# EAGLE design main_v3 (EAGLE 5.10)
TME: 1206YC106KAT2A

## Sheet 1 of 6
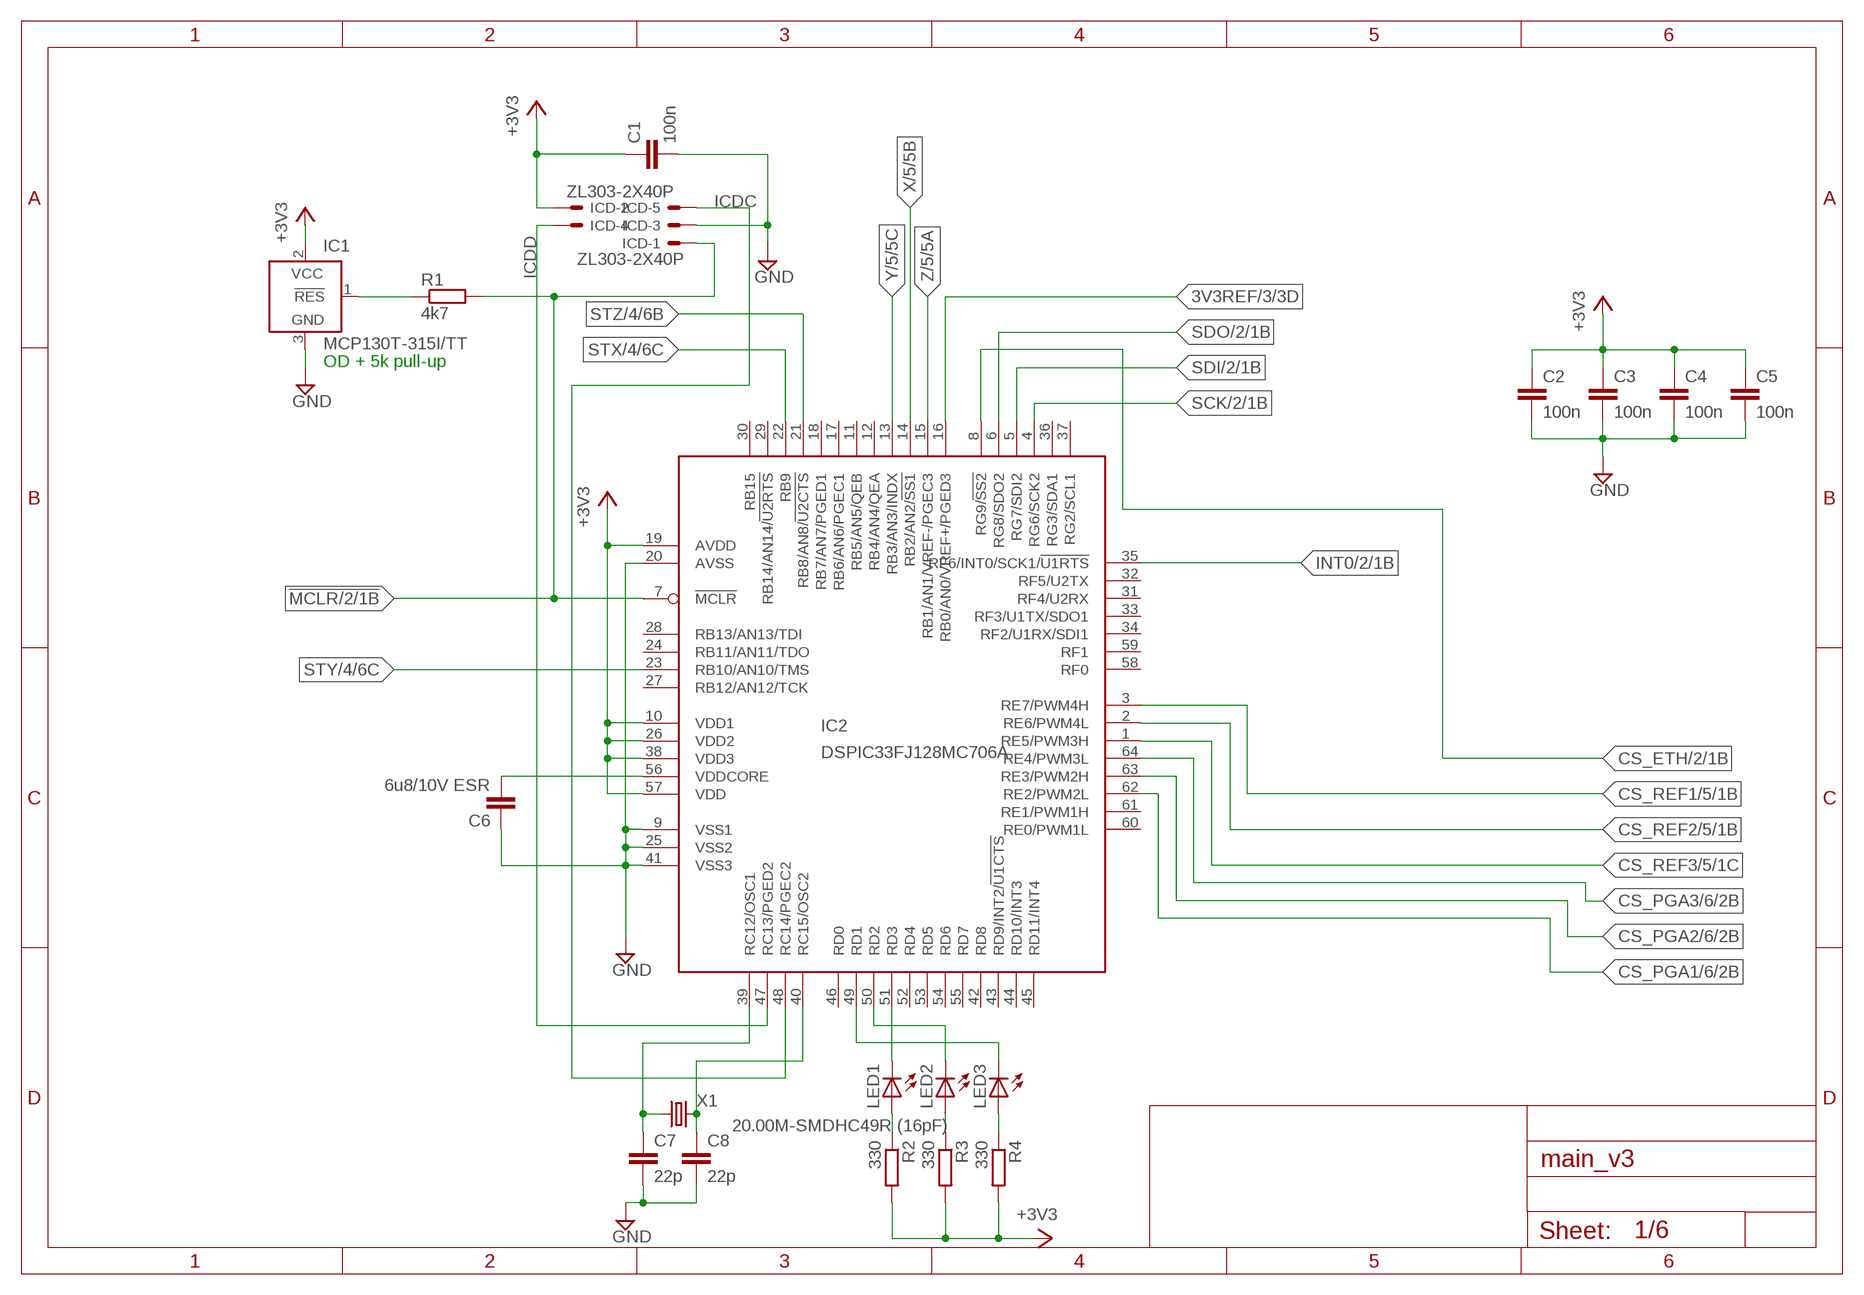
[diagram p0: schematic, sheet 1]

### Parts
C1  100n  C-EUC0805  [C0805]
C2  100n  C-EUC0805  [C0805]
C3  100n  C-EUC0805  [C0805]
C4  100n  C-EUC0805  [C0805]
C5  100n  C-EUC0805  [C0805]
C6  6u8/10V ESR  C-EUC1210  [C1210]
C7  22p  C-EUC0805  [C0805]
C8  22p  C-EUC0805  [C0805]
IC1  MCP130T-315I/TT  MCP10T  [SOT23B-3]
IC2  DSPIC33FJ128MC706A  DSPIC33FJ128MC706  [TQFP64_10X10]
ICD  ZL303-2X40P  87758-0616  [87758-0616]
LED1  LEDCHIPLED_1206  [CHIPLED_1206]
LED2  LEDCHIPLED_1206  [CHIPLED_1206]
LED3  LEDCHIPLED_1206  [CHIPLED_1206]
R1  4k7  R-EU_R0805  [R0805]
R2  330  R-EU_R0805  [R0805]
R3  330  R-EU_R0805  [R0805]
R4  330  R-EU_R0805  [R0805]
X1  20.00M-SMDHC49R (16pF)  CRYSTALHC49UP  [HC49UP]

### Nets
3V3REF: IC2.16(RB0/AN0/VREF+/PGED3) ; also sheet 3
!MCLR: IC2.7(!MCLR) ICD.1 R1.2 ; also sheet 2
+3V3: C1.1 C2.1 C3.1 C4.1 C5.1 IC1.2(VCC) IC2.10(VDD1) IC2.19(AVDD) IC2.26(VDD2) IC2.38(VDD3) IC2.57(VDD) ICD.2 R2.2 R3.2 R4.2 ; also sheet 2,3,5
CS_ETH: IC2.8(RG9/!SS2) ; also sheet 2
CS_PGA1: IC2.62(RE2/PWM2L) ; also sheet 6
CS_PGA2: IC2.63(RE3/PWM2H) ; also sheet 6
CS_PGA3: IC2.64(RE4/PWM3L) ; also sheet 6
CS_REF1: IC2.3(RE7/PWM4H) ; also sheet 5
CS_REF2: IC2.2(RE6/PWM4L) ; also sheet 5
CS_REF3: IC2.1(RE5/PWM3H) ; also sheet 5
GND: C1.2 C2.2 C3.2 C4.2 C5.2 C6.1 C7.2 C8.2 IC1.3(GND) IC2.9(VSS1) IC2.20(AVSS) IC2.25(VSS2) IC2.41(VSS3) ICD.3 ; also sheet 2,3,6
ICDC: IC2.48(RC14/PGEC2) ICD.5
ICDD: IC2.47(RC13/PGED2) ICD.4
INT0: IC2.35(RF6/INT0/SCK1/!U1RTS) ; also sheet 2
LED0: IC2.50(RD2) LED2.C
LED1: IC2.49(RD1) LED3.C
LED2: IC2.51(RD3) LED1.C
N$46: C6.2 IC2.56(VDDCORE)
N$47: IC1.1(!RES) R1.1
N$48: C8.1 IC2.40(RC15/OSC2) X1.2
N$49: C7.1 IC2.39(RC12/OSC1) X1.1
N$60: LED3.A R4.1
N$61: LED2.A R3.1
N$62: LED1.A R2.1
SCK: IC2.4(RG6/SCK2) ; also sheet 2,5,6
SDI: IC2.5(RG7/SDI2) ; also sheet 2
SDO: IC2.6(RG8/SDO2) ; also sheet 2,5,6
STX: IC2.22(RB9) ; also sheet 4
STY: IC2.23(RB10/AN10/TMS) ; also sheet 4
STZ: IC2.21(RB8/AN8/!U2CTS) ; also sheet 4
X: IC2.14(RB2/AN2/!SS1) ; also sheet 5
Y: IC2.13(RB3/AN3/INDX) ; also sheet 5
Z: IC2.15(RB1/AN1/VREF-/PGEC3) ; also sheet 5
Unconnected: IC2.11(RB5/AN5/QEB) IC2.12(RB4/AN4/QEA) IC2.17(RB6/AN6/PGEC1) IC2.18(RB7/AN7/PGED1) IC2.24(RB11/AN11/TDO) IC2.27(RB12/AN12/TCK) IC2.28(RB13/AN13/TDI) IC2.29(RB14/AN14/!U2RTS) IC2.30(RB15) IC2.31(RF4/U2RX) IC2.32(RF5/U2TX) IC2.33(RF3/U1TX/SDO1) IC2.34(RF2/U1RX/SDI1) IC2.36(RG3/SDA1) IC2.37(RG2/SCL1) IC2.42(RD8) IC2.43(RD9/INT2/!U1CTS) IC2.44(RD10/INT3) IC2.45(RD11/INT4) IC2.46(RD0) IC2.52(RD4) IC2.53(RD5) IC2.54(RD6) IC2.55(RD7) IC2.58(RF0) IC2.59(RF1) IC2.60(RE0/PWM1L) IC2.61(RE1/PWM1H) ICD.6

### Notes on the sheet
- OD + 5k pull-up

## Sheet 2 of 6
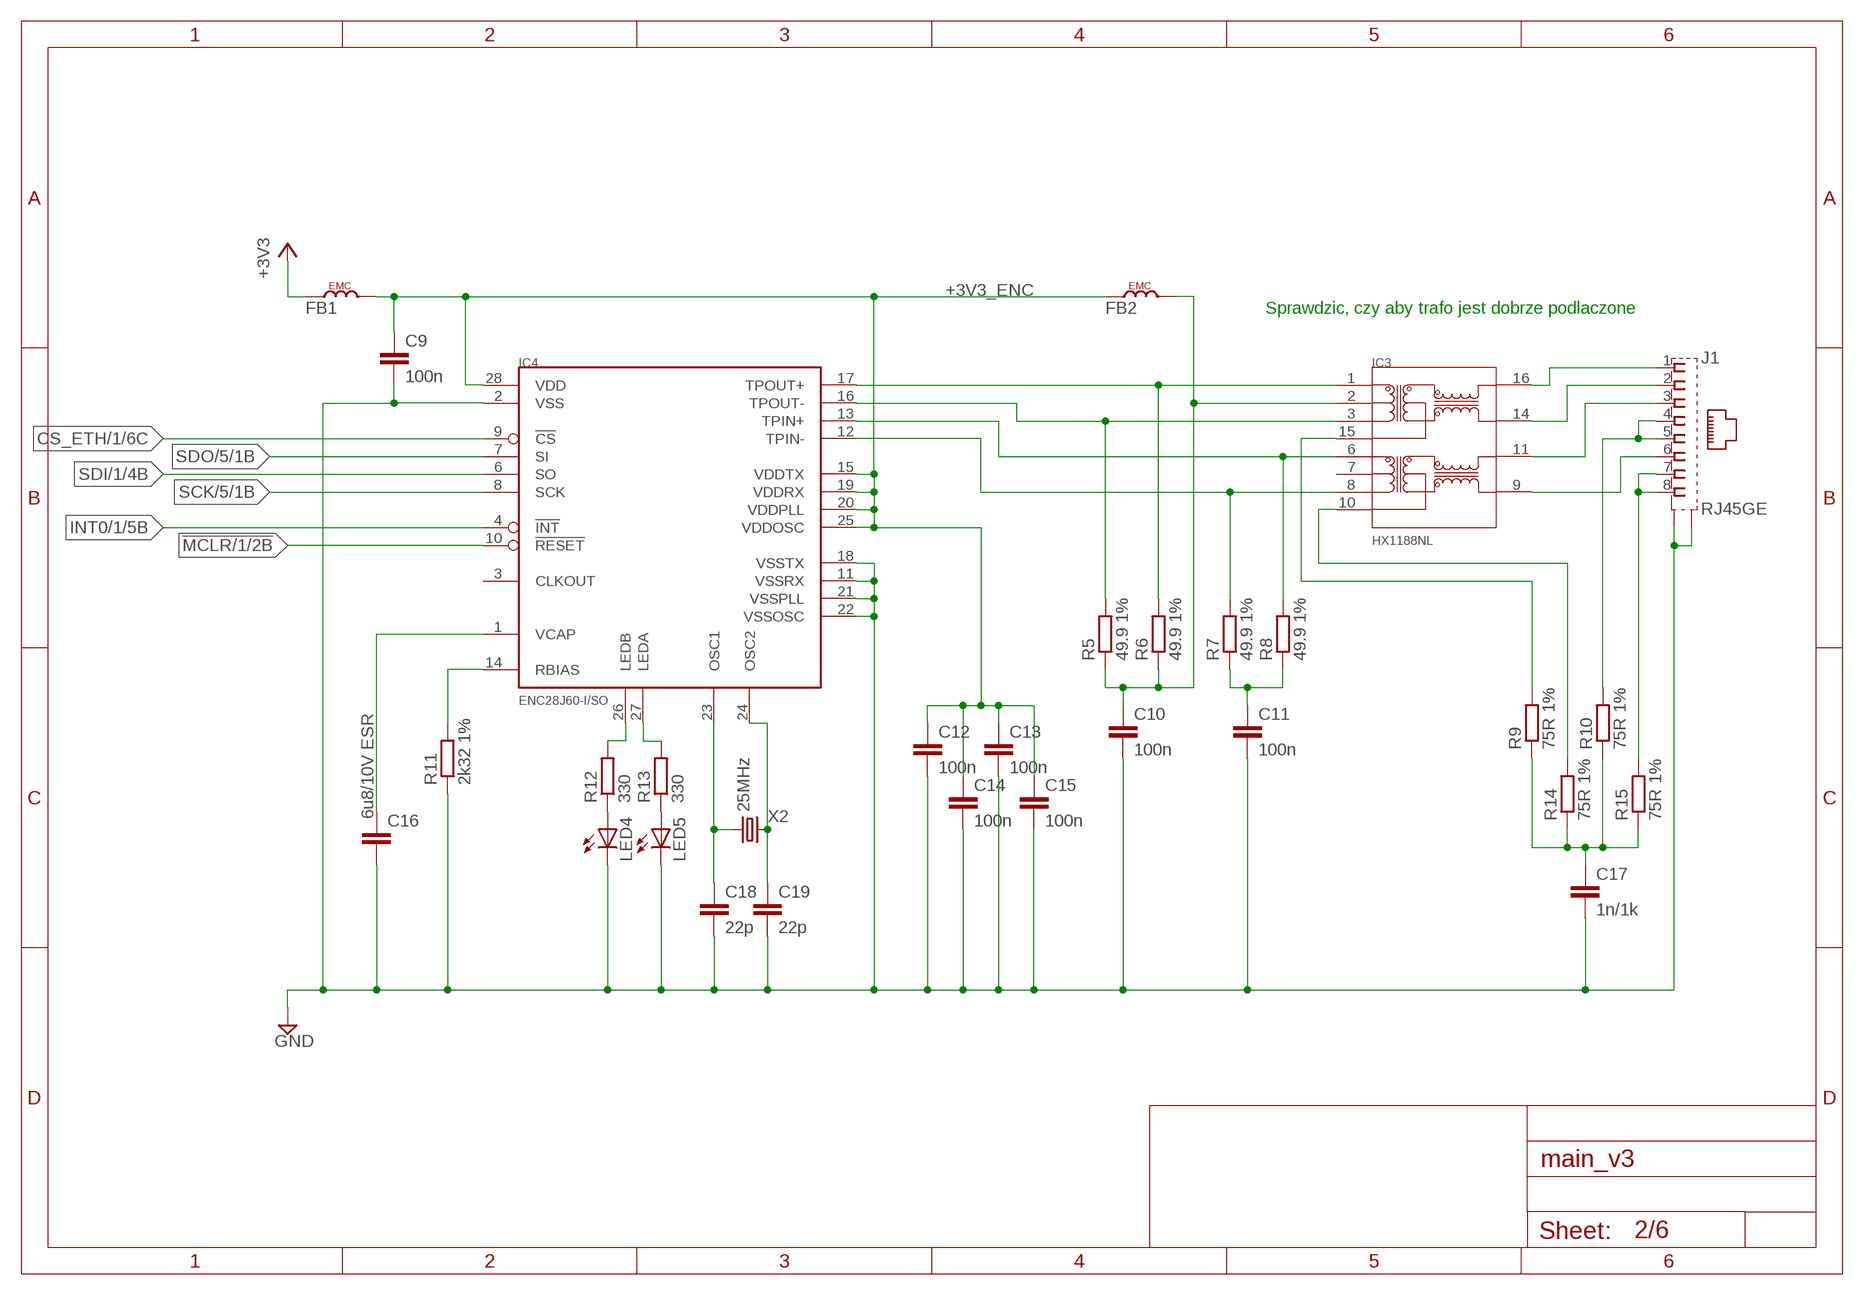
[diagram p1: schematic, sheet 2]

### Parts
C9  100n  C-EUC0805  [C0805]
C10  100n  C-EUC0805  [C0805]
C11  100n  C-EUC0805  [C0805]
C12  100n  C-EUC0805  [C0805]
C13  100n  C-EUC0805  [C0805]
C14  100n  C-EUC0805  [C0805]
C15  100n  C-EUC0805  [C0805]
C16  6u8/10V ESR  C-EUC1210  [C1210]
C17  1n/1k  C-EUC0805  [C0805]
C18  22p  C-EUC0805  [C0805]
C19  22p  C-EUC0805  [C0805]
FB1  FERRITE_BEAD0805  [R0805]
FB2  FERRITE_BEAD0805  [R0805]
IC3  HX1188NL  [TRAFO_H*NL]
IC4  ENC28J60-I/SO  [SO28W]
J1  RJ45GE  555153-1  [555153-1]
LED4  LEDCHIPLED_1206  [CHIPLED_1206]
LED5  LEDCHIPLED_1206  [CHIPLED_1206]
R5  49.9 1%  R-EU_M0805  [M0805]
R6  49.9 1%  R-EU_M0805  [M0805]
R7  49.9 1%  R-EU_M0805  [M0805]
R8  49.9 1%  R-EU_M0805  [M0805]
R9  75R 1%  R-EU_R0805  [R0805]
R10  75R 1%  R-EU_R0805  [R0805]
R11  2k32 1%  R-EU_R1206  [R1206]
R12  330  R-EU_R0805  [R0805]
R13  330  R-EU_R0805  [R0805]
R14  75R 1%  R-EU_R0805  [R0805]
R15  75R 1%  R-EU_R0805  [R0805]
X2  25MHz  CRYSTALHC49UP  [HC49UP]

### Nets
!MCLR: IC4.10(!RESET) ; also sheet 1
+3V3: FB1.1 ; also sheet 1,3,5
+3V3_ENC: C9.1 C12.1 C13.1 C14.1 C15.1 FB1.2 FB2.1 IC4.15(VDDTX) IC4.19(VDDRX) IC4.20(VDDPLL) IC4.25(VDDOSC) IC4.28(VDD)
CS_ETH: IC4.9(!CS) ; also sheet 1
GND: C9.2 C10.2 C11.2 C12.2 C13.2 C14.2 C15.2 C16.2 C17.2 C18.2 C19.2 IC4.2(VSS) IC4.11(VSSRX) IC4.18(VSSTX) IC4.21(VSSPLL) IC4.22(VSSOSC) J1.G1(S1) J1.G2(S2) LED4.C LED5.C R11.1 ; also sheet 1,3,6
INT0: IC4.4(!INT) ; also sheet 1
N$5: IC3.15 R9.2
N$6: C10.1 FB2.2 IC3.2 R5.1 R6.1
N$7: IC3.10 R14.2
N$8: C11.1 R7.1 R8.1
N$9: C17.1 R9.1 R10.1 R14.1 R15.1
N$14: J1.4 J1.5 R10.2
N$15: J1.7 J1.8 R15.2
N$16: C19.1 IC4.24(OSC2) X2.2
N$17: C18.1 IC4.23(OSC1) X2.1
N$18: IC4.14(RBIAS) R11.2
N$19: C16.1 IC4.1(VCAP)
N$22: LED4.A R12.1
N$23: LED5.A R13.1
N$24: IC4.26(LEDB) R12.2
N$25: IC4.27(LEDA) R13.2
SCK: IC4.8(SCK) ; also sheet 1,5,6
SDI: IC4.6(SO) ; also sheet 1
SDO: IC4.7(SI) ; also sheet 1,5,6
TPIN+1: IC3.6 IC4.13(TPIN+) R8.2
TPIN+2: IC3.11 J1.3
TPIN-1: IC3.8 IC4.12(TPIN-) R7.2
TPIN-2: IC3.9 J1.6
TPOUT+1: IC3.1 IC4.17(TPOUT+) R6.2
TPOUT+2: IC3.16 J1.1
TPOUT-1: IC3.3 IC4.16(TPOUT-) R5.2
TPOUT-2: IC3.14 J1.2
Unconnected: IC3.7 IC4.3(CLKOUT)

### Notes on the sheet
- Sprawdzic, czy aby trafo jest dobrze podlaczone

## Sheet 3 of 6
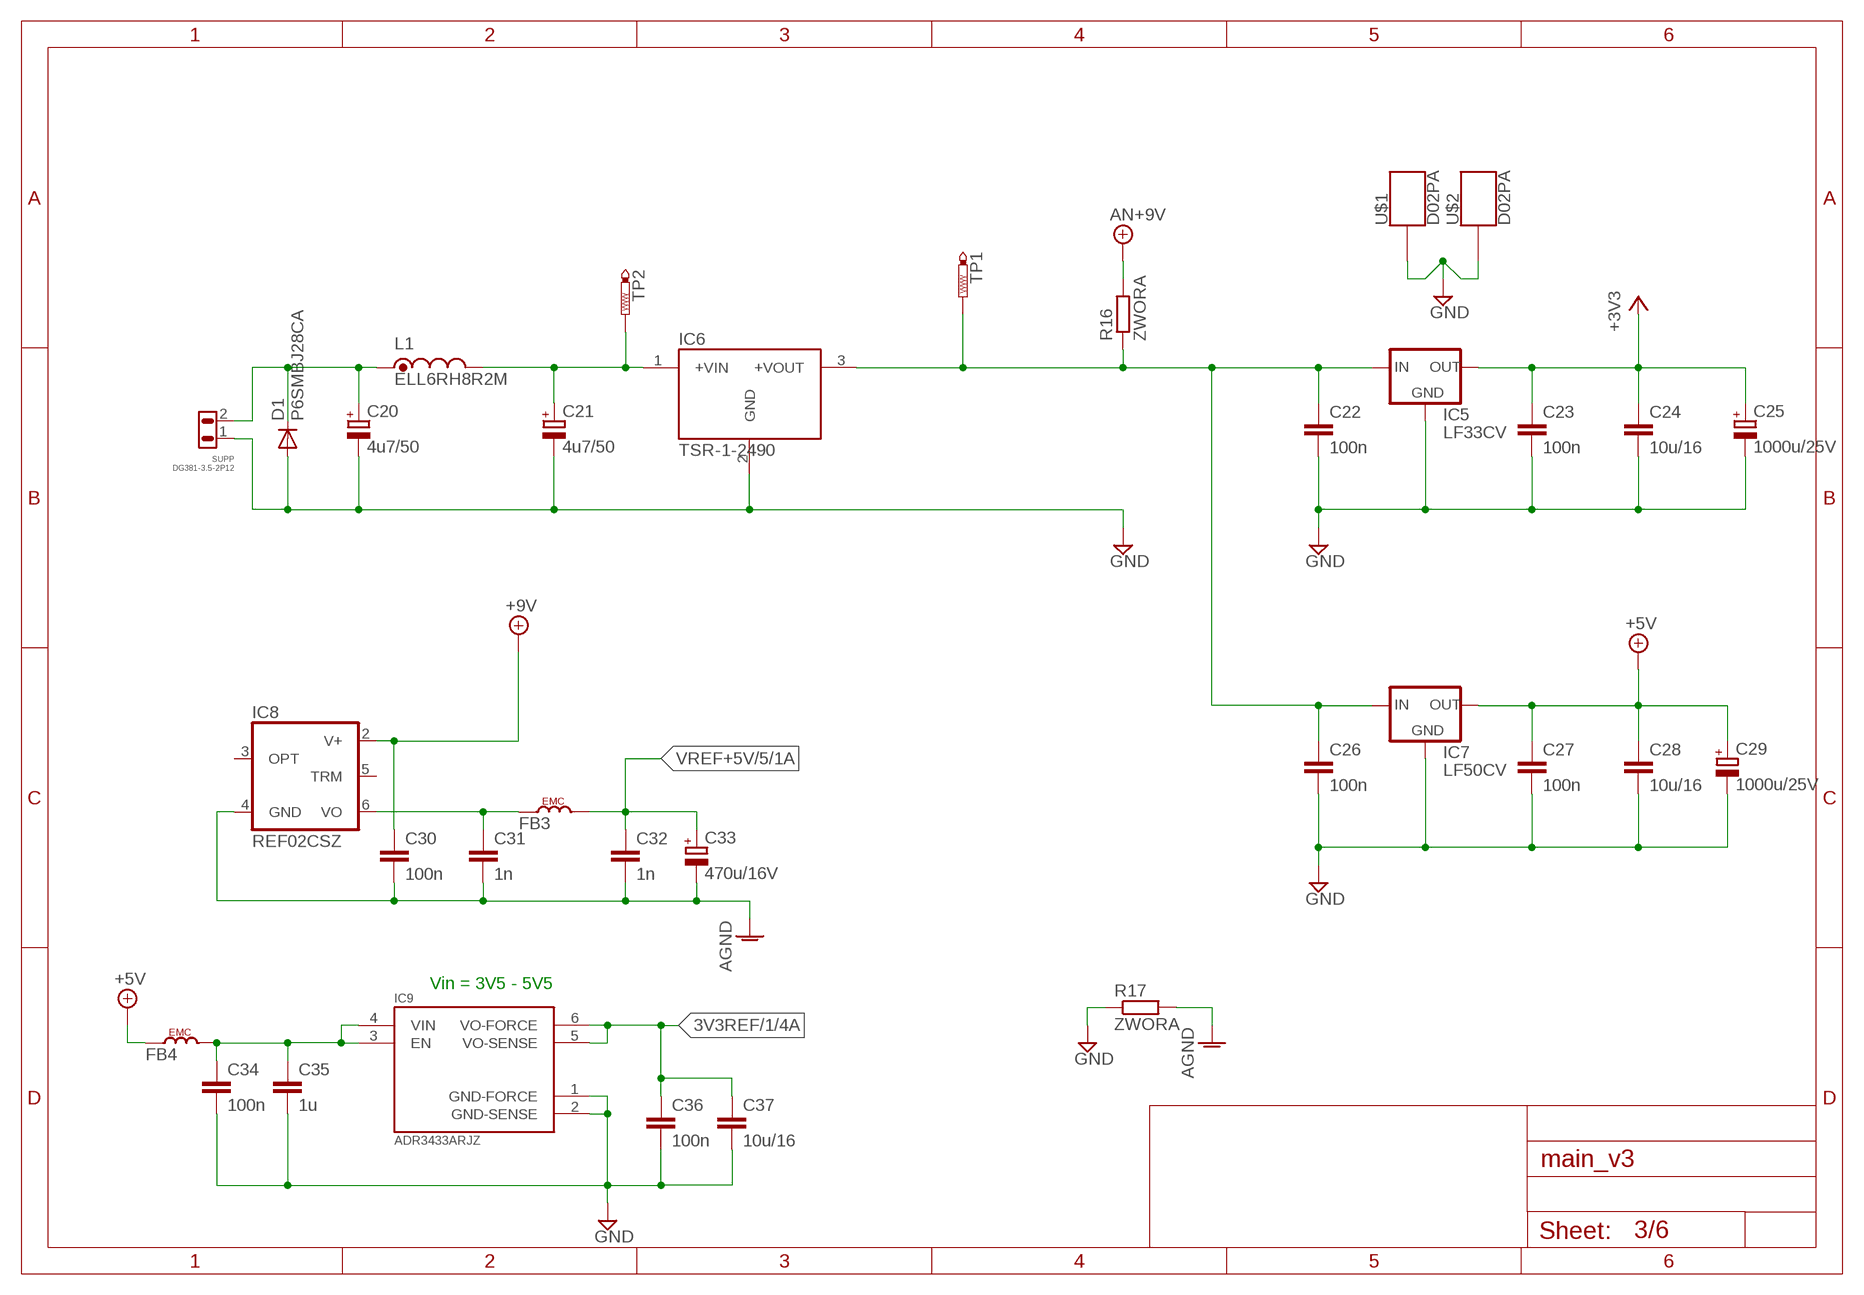
[diagram p2: schematic, sheet 3]

### Parts
C20  4u7/50  CPOL-EUUD-5X5,8  [UD-5X5,8_NICHICON]
C21  4u7/50  CPOL-EUUD-5X5,8  [UD-5X5,8_NICHICON]
C22  100n  C-EUC0805  [C0805]
C23  100n  C-EUC0805  [C0805]
C24  10u/16  C-EUC1206K  [C1206K]
C25  1000u/25V  CPOL-EUTT5D10  [TT5D10]
C26  100n  C-EUC0805  [C0805]
C27  100n  C-EUC0805  [C0805]
C28  10u/16  C-EUC1206K  [C1206K]
C29  1000u/25V  CPOL-EUTT5D10  [TT5D10]
C30  100n  C-EUC0805  [C0805]
C31  1n  C-EUC0805  [C0805]
C32  1n  C-EUC0805  [C0805]
C33  470u/16V  CPOL-EUE3.5-8  [E3,5-8]
C34  100n  C-EUC0805  [C0805]
C35  1u  C-EUC1206  [C1206]
C36  100n  C-EUC0805  [C0805]
C37  10u/16  C-EUC1206K  [C1206K]
D1  P6SMBJ28CA  DIODE-DO214AA  [DO214AA]
FB3  FERRITE_BEAD0805  [R0805]
FB4  FERRITE_BEAD0805  [R0805]
IC5  LF33CV  78XXS  [78XXS]
IC6  TSR-1-2490  [TSR1]
IC7  LF50CV  78XXS  [78XXS]
IC8  REF02CSZ  REF02D  [SO08]
IC9  ADR3433ARJZ  [SOT23-6]
L1  ELL6RH8R2M  [L_PKG_60X60]
R16  ZWORA  R-EU_M1206  [M1206]
R17  ZWORA  R-EU_M1206  [M1206]
SUPP  DG381-3.5-2P12  DG318-3.5-2P  [DG381X2-3.5]
TP1  PTR1PAD1-13  [P1-13]
TP2  PTR1PAD1-13  [P1-13]
U$1  D02PA  [D02PA]
U$2  D02PA  [D02PA]

### Nets
3V3REF: C36.1 C37.1 IC9.5(VO-SENSE) IC9.6(VO-FORCE) ; also sheet 1
+3V3: C23.1 C24.1 C25.+ IC5.OUT ; also sheet 1,2,5
+5V: C27.1 C28.1 C29.+ FB4.1 IC7.OUT ; also sheet 5
AGND: C30.2 C31.2 C32.2 C33.- IC8.4(GND) R17.2 ; also sheet 4,5
AN+9V: C30.1 IC8.2(V+) R16.2 ; supply symbol labelled +9V ; also sheet 4
GND: C20.- C21.- C22.2 C23.2 C24.2 C25.- C26.2 C27.2 C28.2 C29.- C34.2 C35.2 C36.2 C37.2 D1.A IC5.GND IC6.2(GND) IC7.GND IC9.1(GND-FORCE) IC9.2(GND-SENSE) R17.1 SUPP.1 U$1.P$1 U$2.P$1 ; also sheet 1,2,6
N$12: C34.1 C35.1 FB4.2 IC9.3(EN) IC9.4(VIN)
N$13: C31.1 FB3.1 IC8.6(VO)
N$30: C22.1 C26.1 IC5.IN IC6.3(+VOUT) IC7.IN R16.1 TP1.TP
N$35: C21.+ IC6.1(+VIN) L1.2(OUT) TP2.TP
N$41: C20.+ D1.C L1.1(IN) SUPP.2
VREF+5V: C32.1 C33.+ FB3.2 ; also sheet 5
Unconnected: IC8.3(OPT) IC8.5(TRM)

### Notes on the sheet
- Vin = 3V5 - 5V5

## Sheet 4 of 6
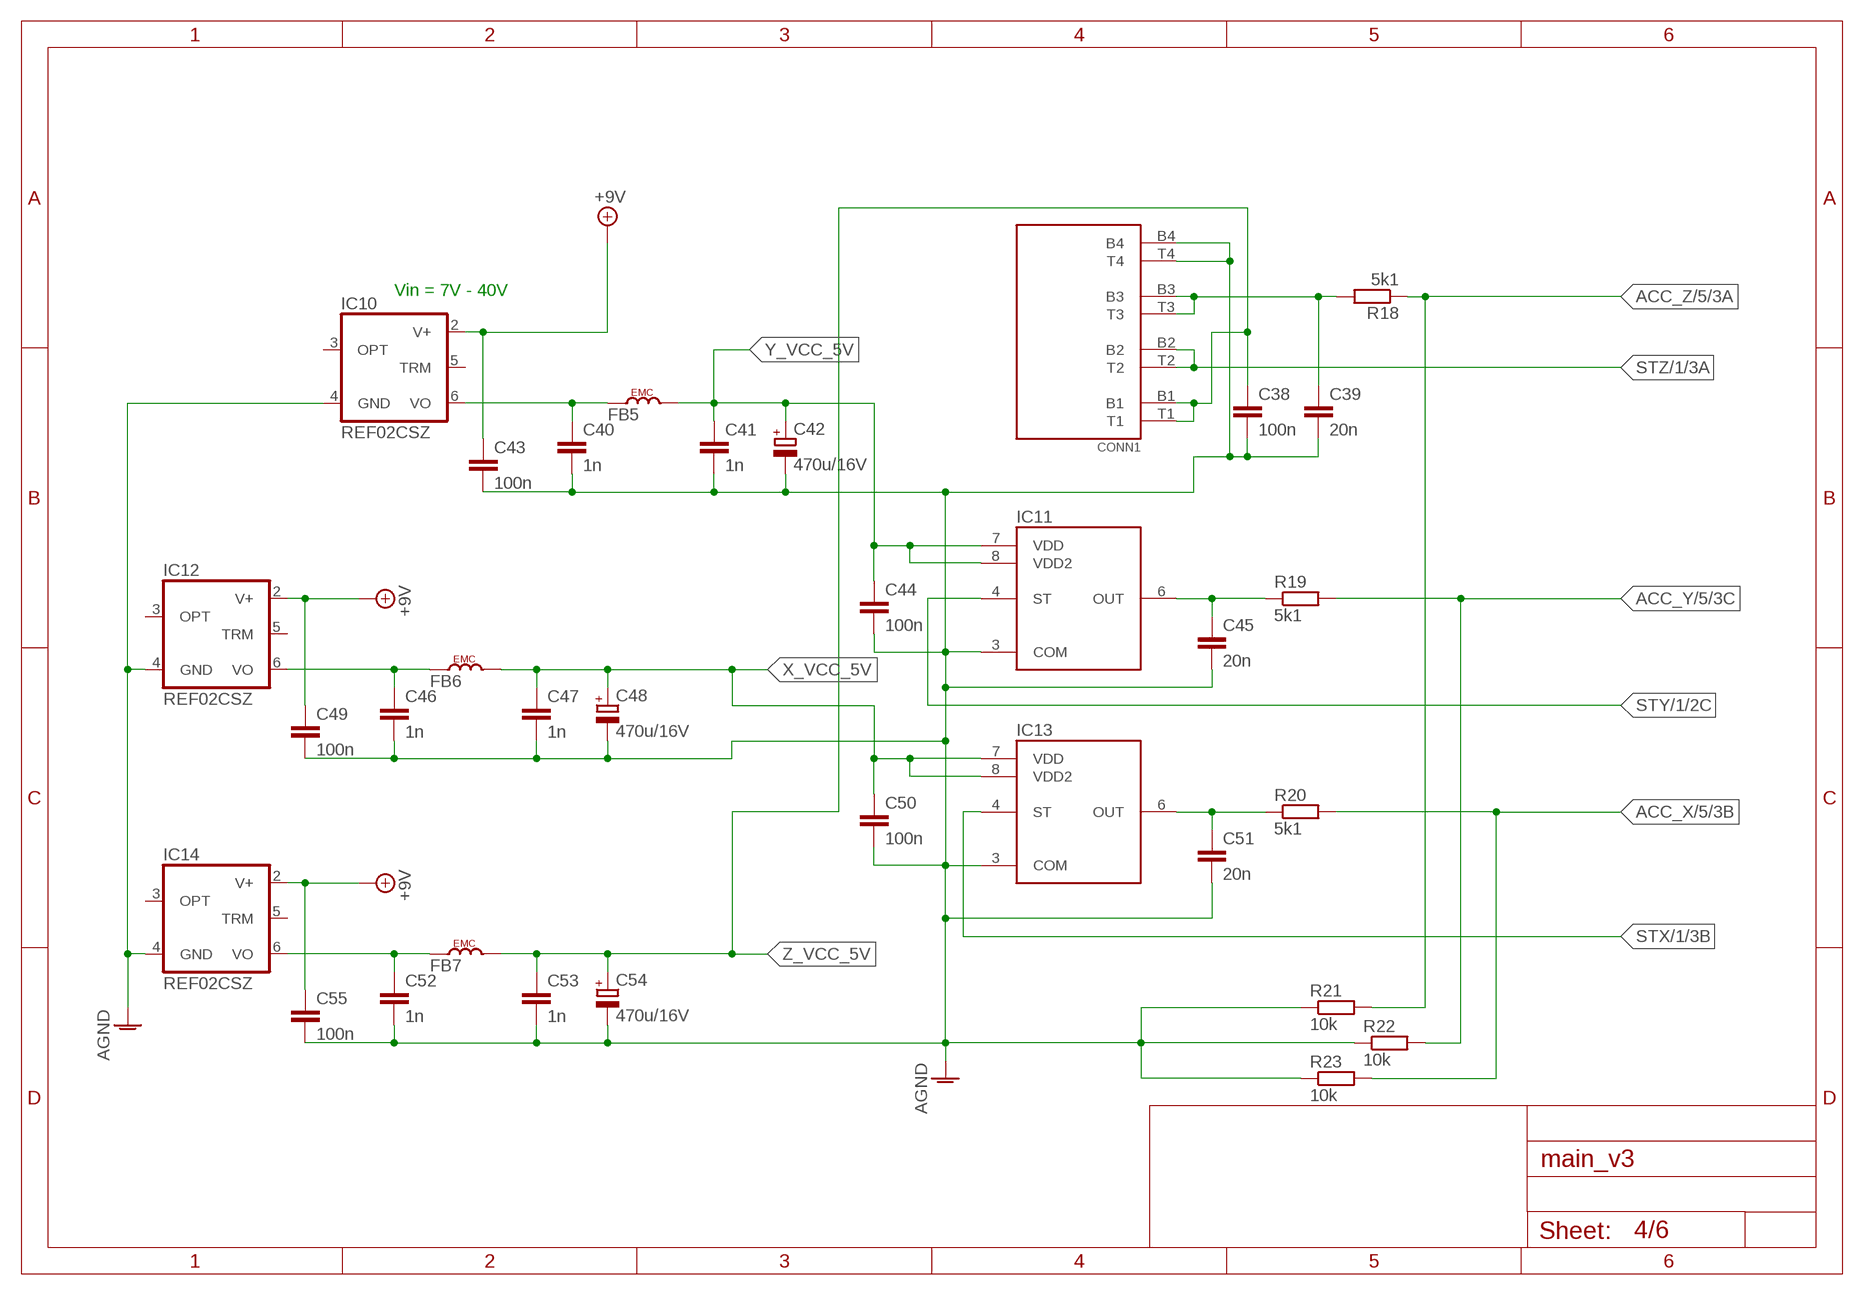
[diagram p3: schematic, sheet 4]

### Parts
C38  100n  C-EUC0805  [C0805]
C39  20n  C-EUC0805  [C0805]
C40  1n  C-EUC0805  [C0805]
C41  1n  C-EUC0805  [C0805]
C42  470u/16V  CPOL-EUE3.5-8  [E3,5-8]
C43  100n  C-EUC0805  [C0805]
C44  100n  C-EUC0805  [C0805]
C45  20n  C-EUC0805  [C0805]
C46  1n  C-EUC0805  [C0805]
C47  1n  C-EUC0805  [C0805]
C48  470u/16V  CPOL-EUE3.5-8  [E3,5-8]
C49  100n  C-EUC0805  [C0805]
C50  100n  C-EUC0805  [C0805]
C51  20n  C-EUC0805  [C0805]
C52  1n  C-EUC0805  [C0805]
C53  1n  C-EUC0805  [C0805]
C54  470u/16V  CPOL-EUE3.5-8  [E3,5-8]
C55  100n  C-EUC0805  [C0805]
CONN1  GNIAZDO4  [GNIAZDO]
FB5  FERRITE_BEAD0805  [R0805]
FB6  FERRITE_BEAD0805  [R0805]
FB7  FERRITE_BEAD0805  [R0805]
IC10  REF02CSZ  REF02D  [SO08]
IC11  ADXL001-70L  [LCC8_LONG]
IC12  REF02CSZ  REF02D  [SO08]
IC13  ADXL001-70L  [LCC8_LONG]
IC14  REF02CSZ  REF02D  [SO08]
R18  5k1  R-EU_M0805  [M0805]
R19  5k1  R-EU_M0805  [M0805]
R20  5k1  R-EU_M0805  [M0805]
R21  10k  R-EU_M0805  [M0805]
R22  10k  R-EU_M0805  [M0805]
R23  10k  R-EU_M0805  [M0805]

### Nets
ACC_X: R20.2 R23.2 ; also sheet 5
ACC_Y: R19.2 R22.2 ; also sheet 5
ACC_Z: R18.1 R21.2 ; also sheet 5
AGND: C38.2 C39.2 C40.2 C41.2 C42.- C43.2 C44.2 C45.2 C46.2 C47.2 C48.- C49.2 C50.2 C51.2 C52.2 C53.2 C54.- C55.2 CONN1.B4 CONN1.T4 IC10.4(GND) IC11.3(COM) IC12.4(GND) IC13.3(COM) IC14.4(GND) R21.1 R22.1 R23.1 ; also sheet 3,5
AN+9V: C43.1 C49.1 C55.1 IC10.2(V+) IC12.2(V+) IC14.2(V+) ; supply symbol labelled +9V ; also sheet 3
N$3: C46.1 FB6.1 IC12.6(VO)
N$4: C52.1 FB7.1 IC14.6(VO)
N$26: C45.1 IC11.6(OUT) R19.1
N$27: C51.1 IC13.6(OUT) R20.1
N$29: C39.1 CONN1.B3 CONN1.T3 R18.2
N$34: C40.1 FB5.1 IC10.6(VO)
STX: IC13.4(ST) ; also sheet 1
STY: IC11.4(ST) ; also sheet 1
STZ: CONN1.B2 CONN1.T2 ; also sheet 1
X_VCC_5V: C47.1 C48.+ C50.1 FB6.2 IC13.7(VDD) IC13.8(VDD2)
Y_VCC_5V: C41.1 C42.+ C44.1 FB5.2 IC11.7(VDD) IC11.8(VDD2)
Z_VCC_5V: C38.1 C53.1 C54.+ CONN1.B1 CONN1.T1 FB7.2
Unconnected: IC10.3(OPT) IC10.5(TRM) IC12.3(OPT) IC12.5(TRM) IC14.3(OPT) IC14.5(TRM)

### Notes on the sheet
- Vin = 7V - 40V

## Sheet 5 of 6
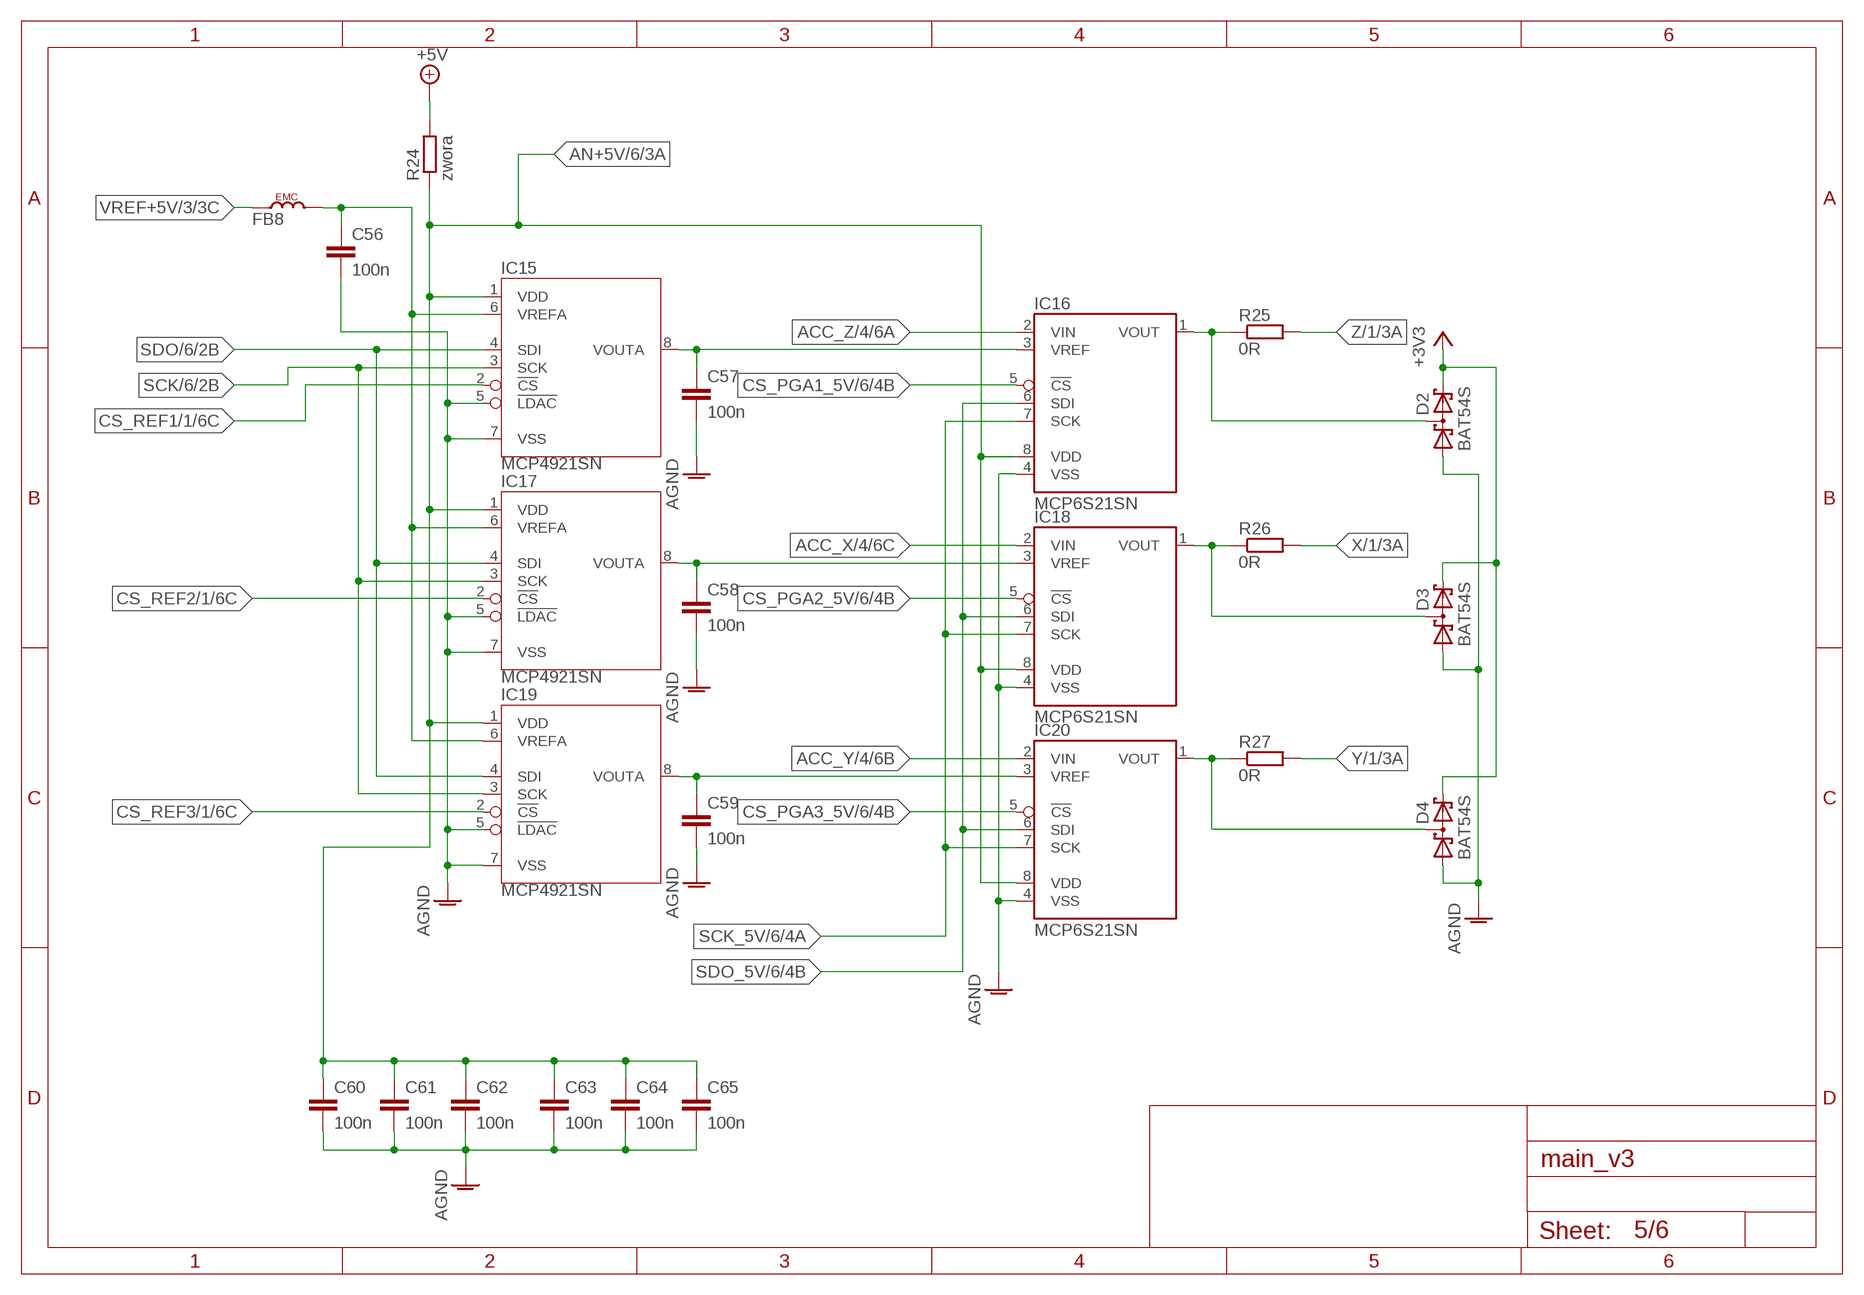
[diagram p4: schematic, sheet 5]

### Parts
C56  100n  C-EUC0805  [C0805]
C57  100n  C-EUC0805  [C0805]
C58  100n  C-EUC0805  [C0805]
C59  100n  C-EUC0805  [C0805]
C60  100n  C-EUC0805  [C0805]
C61  100n  C-EUC0805  [C0805]
C62  100n  C-EUC0805  [C0805]
C63  100n  C-EUC0805  [C0805]
C64  100n  C-EUC0805  [C0805]
C65  100n  C-EUC0805  [C0805]
D2  BAT54S  [SOT23]
D3  BAT54S  [SOT23]
D4  BAT54S  [SOT23]
FB8  FERRITE_BEAD0805  [R0805]
IC15  MCP4921SN  [SO-08]
IC16  MCP6S21SN  [SOIC8]
IC17  MCP4921SN  [SO-08]
IC18  MCP6S21SN  [SOIC8]
IC19  MCP4921SN  [SO-08]
IC20  MCP6S21SN  [SOIC8]
R24  zwora  R-EU_M1206  [M1206]
R25  0R  R-EU_M0805  [M0805]
R26  0R  R-EU_M0805  [M0805]
R27  0R  R-EU_M0805  [M0805]

### Nets
+3V3: D2.2(C2) D3.2(C2) D4.2(C2) ; also sheet 1,2,3
+5V: R24.2 ; also sheet 3
ACC_X: IC18.2(VIN) ; also sheet 4
ACC_Y: IC20.2(VIN) ; also sheet 4
ACC_Z: IC16.2(VIN) ; also sheet 4
AGND: C56.2 C57.2 C58.2 C59.2 C60.2 C61.2 C62.2 C63.2 C64.2 C65.2 D2.1(A1) D3.1(A1) D4.1(A1) IC15.5(!LDAC) IC15.7(VSS) IC16.4(VSS) IC17.5(!LDAC) IC17.7(VSS) IC18.4(VSS) IC19.5(!LDAC) IC19.7(VSS) IC20.4(VSS) ; also sheet 3,4
AN+5V: C60.1 C61.1 C62.1 C63.1 C64.1 C65.1 IC15.1(VDD) IC16.8(VDD) IC17.1(VDD) IC18.8(VDD) IC19.1(VDD) IC20.8(VDD) R24.1 ; also sheet 6
CS_PGA1_5V: IC16.5(!CS) ; also sheet 6
CS_PGA2_5V: IC18.5(!CS) ; also sheet 6
CS_PGA3_5V: IC20.5(!CS) ; also sheet 6
CS_REF1: IC15.2(!CS) ; also sheet 1
CS_REF2: IC17.2(!CS) ; also sheet 1
CS_REF3: IC19.2(!CS) ; also sheet 1
N$1: C57.1 IC15.8(VOUTA) IC16.3(VREF)
N$2: C58.1 IC17.8(VOUTA) IC18.3(VREF)
N$11: C56.1 FB8.2 IC15.6(VREFA) IC17.6(VREFA) IC19.6(VREFA)
N$20: C59.1 IC19.8(VOUTA) IC20.3(VREF)
SCK: IC15.3(SCK) IC17.3(SCK) IC19.3(SCK) ; also sheet 1,2,6
SCK_5V: IC16.7(SCK) IC18.7(SCK) IC20.7(SCK) ; also sheet 6
SDO: IC15.4(SDI) IC17.4(SDI) IC19.4(SDI) ; also sheet 1,2,6
SDO_5V: IC16.6(SDI) IC18.6(SDI) IC20.6(SDI) ; also sheet 6
VREF+5V: FB8.1 ; also sheet 3
X: R26.2 ; also sheet 1
XAMP: D3.3(C1A2) IC18.1(VOUT) R26.1
Y: R27.2 ; also sheet 1
YAMP: D4.3(C1A2) IC20.1(VOUT) R27.1
Z: R25.2 ; also sheet 1
ZAMP: D2.3(C1A2) IC16.1(VOUT) R25.1

## Sheet 6 of 6
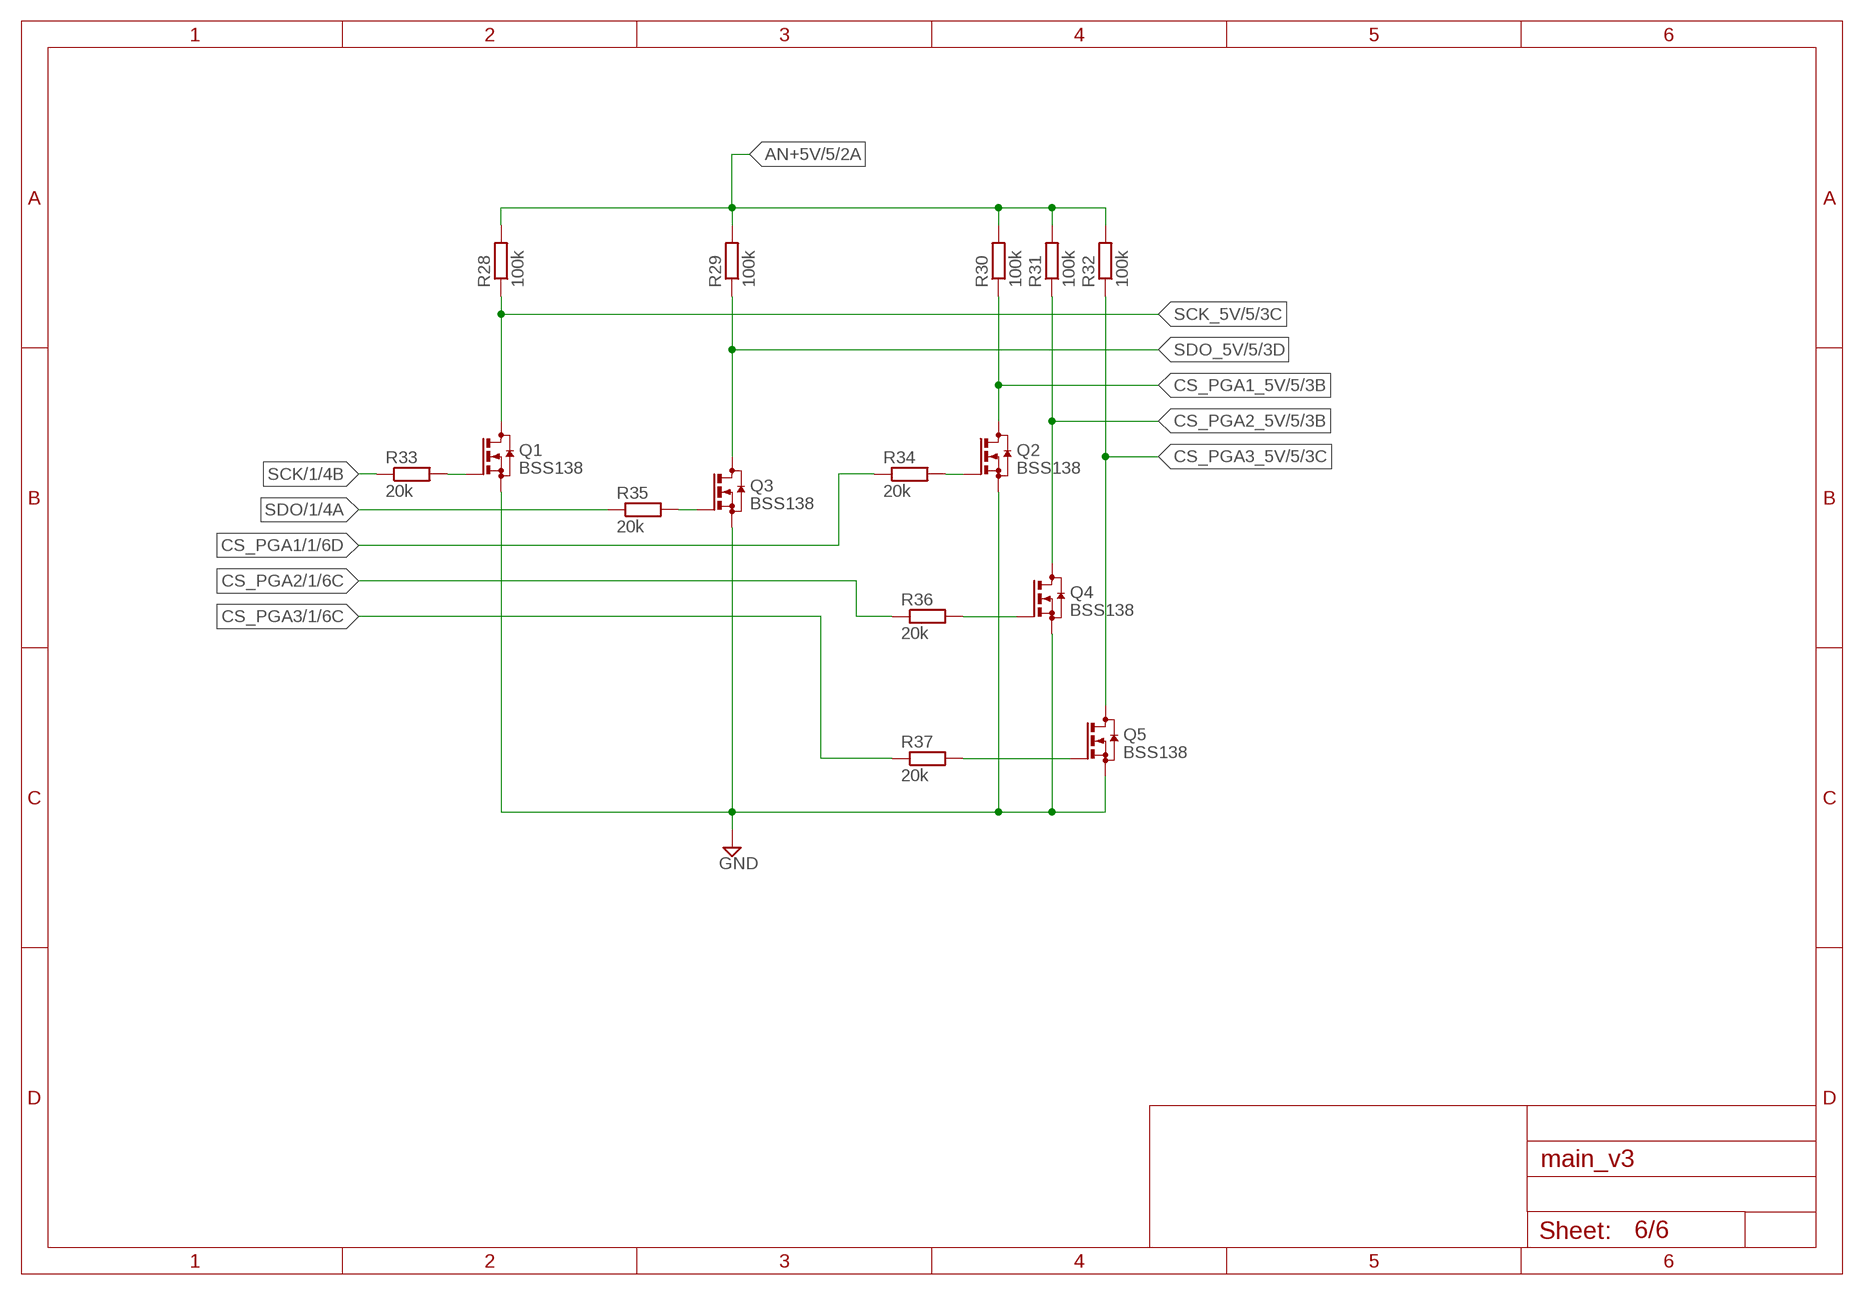
[diagram p5: schematic, sheet 6]

### Parts
Q1  BSS138  BSS123  [SOT23]
Q2  BSS138  BSS123  [SOT23]
Q3  BSS138  BSS123  [SOT23]
Q4  BSS138  BSS123  [SOT23]
Q5  BSS138  BSS123  [SOT23]
R28  100k  R-EU_M0805  [M0805]
R29  100k  R-EU_M0805  [M0805]
R30  100k  R-EU_M0805  [M0805]
R31  100k  R-EU_M0805  [M0805]
R32  100k  R-EU_M0805  [M0805]
R33  20k  R-EU_M0805  [M0805]
R34  20k  R-EU_M0805  [M0805]
R35  20k  R-EU_M0805  [M0805]
R36  20k  R-EU_M0805  [M0805]
R37  20k  R-EU_M0805  [M0805]

### Nets
AN+5V: R28.2 R29.2 R30.2 R31.2 R32.2 ; also sheet 5
CS_PGA1: R34.1 ; also sheet 1
CS_PGA1_5V: Q2.3(D) R30.1 ; also sheet 5
CS_PGA2: R36.1 ; also sheet 1
CS_PGA2_5V: Q4.3(D) R31.1 ; also sheet 5
CS_PGA3: R37.1 ; also sheet 1
CS_PGA3_5V: Q5.3(D) R32.1 ; also sheet 5
GND: Q1.2(S) Q2.2(S) Q3.2(S) Q4.2(S) Q5.2(S) ; also sheet 1,2,3
N$10: Q2.1(G) R34.2
N$21: Q5.1(G) R37.2
N$36: Q1.1(G) R33.2
N$51: Q3.1(G) R35.2
N$53: Q4.1(G) R36.2
SCK: R33.1 ; also sheet 1,2,5
SCK_5V: Q1.3(D) R28.1 ; also sheet 5
SDO: R35.1 ; also sheet 1,2,5
SDO_5V: Q3.3(D) R29.1 ; also sheet 5

## Library data of the parts
C1-C19 C22-C24 C26-C28 C30-C32 C34-C41 C43-C47 C49-C53 C55-C65 = rcl:C-EU: CAPACITOR, European symbol
C20 C21 C25 C29 C33 C42 C48 C54 = rcl:CPOL-EU: POLARIZED CAPACITOR, European symbol
CONN1 = mechanika:GNIAZDO4
D1 = diode:DIODE-: DIODE
D2-D4 = diode:BAT54S: Schottky Diodes Source: Fairchild .. BAT54.pdf
FB1-FB8 = passives:FERRITE_BEAD
IC1 = lib1:MCP1*0T: POWER SUPPLY MONITOR replacement for Maxim MAX809 and MAX810
IC2 = lib1:DSPIC33FJ128MC706: DSPIC33FJ128MC706 edit this description Auto generated by make-symbol-device-package-bsdl.ulp Rev. 34 Source: DSPIC33FJ128MC706.bsdl
IC3 = lib1:HX1188NL
IC4 = lib1:ENC28J60
IC5 IC7 = v-reg:78XXS: VOLTAGE REGULATOR
IC6 = lib1:TSR-1-2490
IC8 IC10 IC12 IC14 = linear:REF02: VOLTAGE REFERENCE
IC9 = lib1:ADR3433ARJZ
IC11 IC13 = lib1:ADXL001
IC15 IC17 IC19 = moje:MCP4921
IC16 IC18 IC20 = lib1:MCP6S21
ICD = con-molex:87758-0616: 6 Pin - 2mm Dual Row Single Wafer, Vertical T/H HDR Source: http://www.molex.com/pdm_docs/sd/877580616_sd.pdf
J1 = con-amp:555153-1: AMP connector
L1 = lib1:ELL6RH8R2M
LED1-LED5 = led:LED: LED OSRAM: - CHIPLED LG R971, LG N971, LY N971, LG Q971, LY Q971, LO R971, LY R971 LH N974, LH R974 LS Q976, LO Q976, LY Q976 LO Q996 - Hyper CHIPLED LW Q18S LB Q993, LB Q99A, LB R99A - SideLED LS A670, LO A670, LY A670, LG A670, LP A670 LB A673, LV A673, LT A673, LW A673 LH A674 LY A675 LS A676, LA A676, LO A676, LY A676, LW A676 LS A679, LY A679, LG A679 - Hyper Micro SIDELED® LS Y876, LA Y876, LO Y876, LY Y876 LT Y87S - SmartLED LW L88C, LW L88S LB L89C, LB L89S, LG L890 LS L89K, LO L89K, LY L89K LS L896, LA L896, LO L896, LY L896 - TOPLED LS T670, LO T670, LY T670, LG T670, LP T670 LSG T670, LSP T670, LSY T670, LOP T670, LYG T670 LG T671, LOG T671, LSG T671 LB T673, LV T673, LT T673, LW T673 LH T674 LS T676, LA T676, LO T676, LY T676, LB T676, LH T676, LSB T676, LW T676 LB T67C, LV T67C, LT T67C, LS T67K, LO T67K, LY T67K, LW E67C LS E67B, LA E67B, LO E67B, LY E67B, LB E67C, LV E67C, LT E67C LW T67C LS T679, LY T679, LG T679 LS T770, LO T770, LY T770, LG T770, LP T770 LB T773, LV T773, LT T773, LW T773 LH T774 LS E675, LA E675, LY E675, LS T675 LS T776, LA T776, LO T776, LY T776, LB T776 LHGB T686 LT T68C, LB T68C - Hyper Mini TOPLED® LB M676 - Mini TOPLED Santana® LG M470 LS M47K, LO M47K, LY M47K Source: http://www.osram.convergy.de LUXEON: - LUMILED® LXK2-PW12-R00, LXK2-PW12-S00, LXK2-PW14-U00, LXK2-PW14-V00 LXK2-PM12-R00, LXK2-PM12-S00, LXK2-PM14-U00 LXK2-PE12-Q00, LXK2-PE12-R00, LXK2-PE12-S00, LXK2-PE14-T00, LXK2-PE14-U00 LXK2-PB12-K00, LXK2-PB12-L00, LXK2-PB12-M00, LXK2-PB14-N00, LXK2-PB14-P00, LXK2-PB14-Q00 LXK2-PR12-L00, LXK2-PR12-M00, LXK2-PR14-Q00, LXK2-PR14-R00 LXK2-PD12-Q00, LXK2-PD12-R00, LXK2-PD12-S00 LXK2-PH12-R00, LXK2-PH12-S00 LXK2-PL12-P00, LXK2-PL12-Q00, LXK2-PL12-R00 Source: www.luxeon.com KINGBRIGHT: KA-3528ASYC Source: www.kingbright.com
Q1-Q5 = transistor-small-signal:BSS123: N-CHANNEL MOS FET
R1-R37 = rcl:R-EU_: RESISTOR, European symbol
SUPP = connectors:DG318-3.5-2P
TP1 TP2 = testpad:PTR1: TEST PIN
U$1 U$2 = lib-radiatory:D02PA
X1 X2 = crystal:CRYSTAL: CRYSTAL

## Board
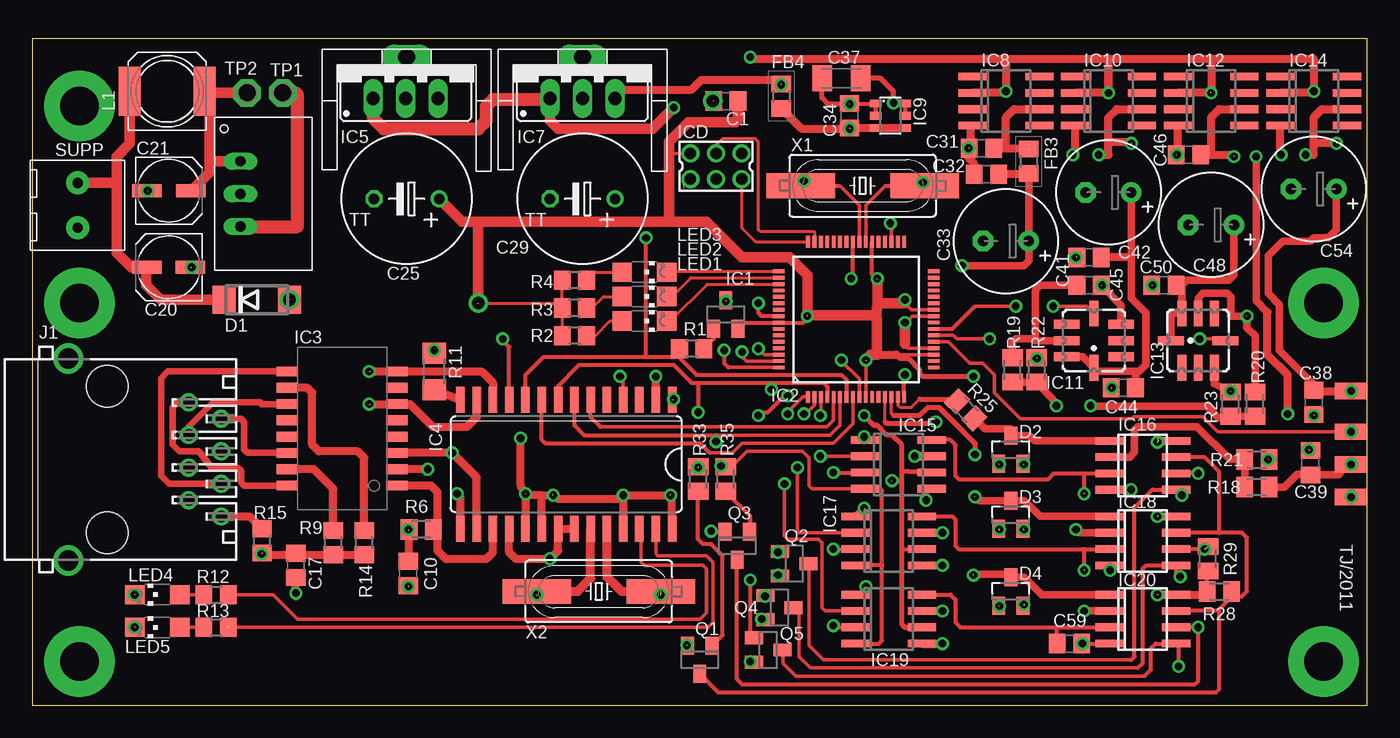
[diagram p6: board, top side]
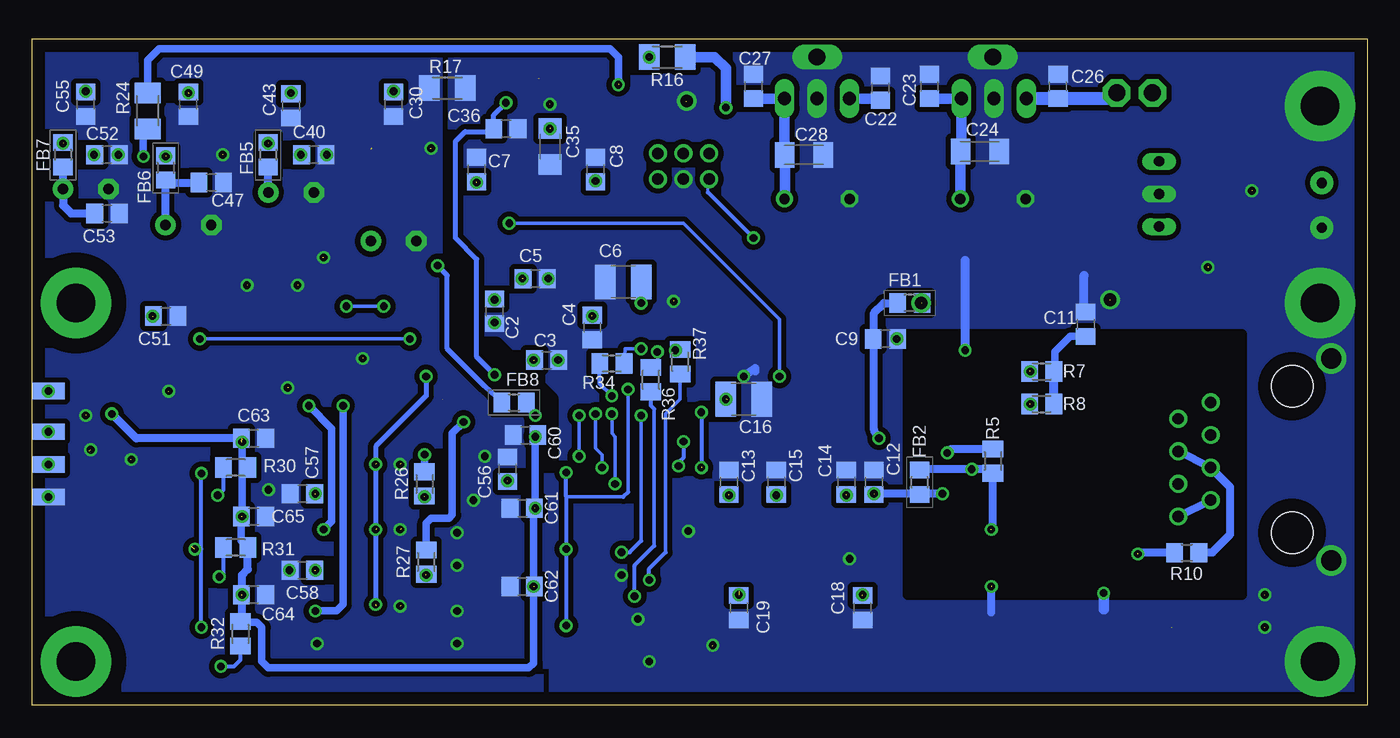
[diagram p7: board, bottom side, seen from below]

Size 104.12 x 51.99 mm. Coordinates in mm from the lower left corner, seen from the top.
Outline: 0,0 104.12,0 104.12,51.99 0,51.99 0,0
Copper layers (1*16): Top 0.035mm / dielectric 1.5mm / Bottom 0.035mm
Design rules "drukowane.pl *": minimum track width 8mil, minimum drill 16mil, track to track 8mil, track to pad 8mil, pad to pad 8mil, via to via 8mil, smd to smd 0mil, copper to edge 40mil, drill to drill 8mil, minimum pad ring 10mil, minimum via ring 8mil, stop-mask expansion 4mil, vias tented up to drill 0mil, thermal gap 10mil
bRestrict: area 9.8,8.6 to 35.8,29; area 97.2,27.9 to 104.2,34.9; area 97.2,-0.1 to 104.2,6.9; 3 lines

### Footprints (pad centres in the part's own frame; a part is rotated, then mirrored left to right if it is on the bottom)
C0805 = smd 1.3 x 1.5: 1 -0.95,0; 2 0.95,0
C1210 = smd 1.6 x 2.7: 1 -1.4,0; 2 1.4,0
UD-5X5,8_NICHICON = smd 2.3 x 1: + 1.725,0; - -1.7,0
C1206K = smd 1.5 x 2: 1 -1.5,0; 2 1.5,0
TT5D10 = drill 0.813 round: + -2.54,0 | drill 0.813 octagon: - 2.54,0
E3,5-8 = drill 0.813 pad 1.6 round: + -1.778,0 | drill 0.813 pad 1.6 octagon: - 1.778,0
C1206 = smd 1.6 x 1.8: 1 -1.4,0; 2 1.4,0
GNIAZDO = smd 2.54 x 1.27 bottom: B1 0,4.445; B2 0,1.27; B3 0,-1.27; B4 0,-3.81 | smd 2.54 x 1.27: T1 0,4.445; T2 0,1.27; T3 0,-1.27; T4 0,-3.81
DO214AA = smd 1.8 x 2.2: A 2.55,0; C -2.55,0
SOT23 = smd 1 x 1.4: 1 -0.95,-1.1; 2 0.95,-1.1; 3 0,1.1
R0805 = smd 1.3 x 1.5: 1 -0.95,0; 2 0.95,0
SOT23B-3 = smd 1 x 1.4: 1 -0.95,-1.1; 2 0.95,-1.1; 3 0,1.1
TQFP64_10X10 = smd 0.9 x 0.3: 1 -6.05,3.75; 2 -6.05,3.25; 3 -6.05,2.75; 4 -6.05,2.25; 5 -6.05,1.75; 6 -6.05,1.25; 7 -6.05,0.75; 8 -6.05,0.25; 9 -6.05,-0.25; 10 -6.05,-0.75; 11 -6.05,-1.25; 12 -6.05,-1.75; 13 -6.05,-2.25; 14 -6.05,-2.75; 15 -6.05,-3.25; 16 -6.05,-3.75; 33 6.05,-3.75; 34 6.05,-3.25; 35 6.05,-2.75; 36 6.05,-2.25; 37 6.05,-1.75; 38 6.05,-1.25; 39 6.05,-0.75; 40 6.05,-0.25; 41 6.05,0.25; 42 6.05,0.75; 43 6.05,1.25; 44 6.05,1.75; 45 6.05,2.25; 46 6.05,2.75; 47 6.05,3.25; 48 6.05,3.75 | smd 0.3 x 0.9: 17 -3.75,-6.05; 18 -3.25,-6.05; 19 -2.75,-6.05; 20 -2.25,-6.05; 21 -1.75,-6.05; 22 -1.25,-6.05; 23 -0.75,-6.05; 24 -0.25,-6.05; 25 0.25,-6.05; 26 0.75,-6.05; 27 1.25,-6.05; 28 1.75,-6.05; 29 2.25,-6.05; 30 2.75,-6.05; 31 3.25,-6.05; 32 3.75,-6.05; 49 3.75,6.05; 50 3.25,6.05; 51 2.75,6.05; 52 2.25,6.05; 53 1.75,6.05; 54 1.25,6.05; 55 0.75,6.05; 56 0.25,6.05; 57 -0.25,6.05; 58 -0.75,6.05; 59 -1.25,6.05; 60 -1.75,6.05; 61 -2.25,6.05; 62 -2.75,6.05; 63 -3.25,6.05; 64 -3.75,6.05
TRAFO_H*NL = smd 0.76 x 1.67: 1 -4.445,-4.445; 2 -3.175,-4.445; 3 -1.905,-4.445; 4 -0.635,-4.445; 5 0.635,-4.445; 6 1.905,-4.445; 7 3.175,-4.445; 8 4.445,-4.445; 9 4.445,4.089; 10 3.175,4.089; 11 1.905,4.089; 12 0.635,4.089; 13 -0.635,4.089; 14 -1.905,4.089; 15 -3.175,4.089; 16 -4.445,4.089
SO28W = smd 0.66 x 2.032: 1 -8.255,-5.029; 2 -6.985,-5.029; 3 -5.715,-5.029; 4 -4.445,-5.029; 5 -3.175,-5.029; 6 -1.905,-5.029; 7 -0.635,-5.029; 8 0.635,-5.029; 9 1.905,-5.029; 10 3.175,-5.029; 11 4.445,-5.029; 12 5.715,-5.029; 13 6.985,-5.029; 14 8.255,-5.029; 15 8.255,5.029; 16 6.985,5.029; 17 5.715,5.029; 18 4.445,5.029; 19 3.175,5.029; 20 1.905,5.029; 21 0.635,5.029; 22 -0.635,5.029; 23 -1.905,5.029; 24 -3.175,5.029; 25 -4.445,5.029; 26 -5.715,5.029; 27 -6.985,5.029; 28 -8.255,5.029
78XXS = drill 1.016 long: GND 0,-2.54; IN -2.54,-2.54; OUT 2.54,-2.54
TSR1 = drill 0.8 long: 1 2.54,0; 2 0,0; 3 -2.54,0
SO08 = smd 0.6 x 2.2: 1 -1.905,-2.6; 2 -0.635,-2.6; 3 0.635,-2.6; 4 1.905,-2.6; 5 1.905,2.6; 6 0.635,2.6; 7 -0.635,2.6; 8 -1.905,2.6
SOT23-6 = smd 0.6 x 0.9: 1 -0.95,-1.15; 2 0,-1.15; 3 0.95,-1.15; 4 0.95,1.15; 5 0,1.15; 6 -0.95,1.15
LCC8_LONG = smd 2 x 0.7: 1 -2.121,1.27; 2 -2.121,0; 3 -2.121,-1.27; 5 2.121,-1.27; 6 2.121,0; 7 2.121,1.27 | smd 0.7 x 2: 4 0,-2.121; 8 0,2.121
SO-08 = smd 0.6 x 2.2: 1 -0.635,-2.6; 2 0.635,-2.6; 3 1.905,-2.6; 4 3.175,-2.6; 5 3.175,2.6; 6 1.905,2.6; 7 0.635,2.6; 8 -0.635,2.6
SOIC8 = smd 0.6 x 2.2: 1 -1.905,-2.6; 2 -0.635,-2.6; 3 0.635,-2.6; 4 1.905,-2.6; 5 1.905,2.6; 6 0.635,2.6; 7 -0.635,2.6; 8 -1.905,2.6
87758-0616 = drill 0.9 pad 1.27 round: 1 -2,-1; 2 -2,1; 3 0,-1; 4 0,1; 5 2,-1; 6 2,1
555153-1 = drill 0.889 round: 1 -4.445,6.35; 2 -3.175,8.89; 3 -1.905,6.35; 4 -0.635,8.89; 5 0.635,6.35; 6 1.905,8.89; 7 3.175,6.35; 8 4.445,8.89 | drill 1.575 pad 2.184 round: G1 -7.874,-3.048; G2 7.874,-3.048 | hole 3.251: -5.715,0; 5.715,0
L_PKG_60X60 = smd 1.7 x 3.8: 1 -2.921,0; 2 2.921,0
CHIPLED_1206 = smd 1.5 x 1.5: A 0,-1.75; C 0,1.75
M0805 = smd 1.3 x 1.6: 1 -0.95,0; 2 0.95,0
R1206 = smd 1.6 x 1.803: 1 -1.422,0; 2 1.422,0
M1206 = smd 1.6 x 2: 1 -1.4,0; 2 1.4,0
DG381X2-3.5 = drill 0.8 pad 1.778 round: 1 -1.75,0; 2 1.75,0
P1-13 = drill 1.321 pad 2.159 octagon: TP 0,0
D02PA = drill 1.3 long: P$1 0,0
HC49UP = smd 5.334 x 1.93: 1 -4.826,0; 2 4.826,0

### Placement (x,y rotation side)
C1  54.1,47.12 180 top
C2  68.07,30.73 270 bottom
C3  64.01,26.92 0 bottom
C4  60.45,29.46 270 bottom
C5  64.9,33.27 0 bottom
C6  58.04,33.02 0 bottom
C7  69.47,41.78 90 bottom
C8  60.2,41.78 90 bottom
C9  37.59,28.57 0 bottom
C10  29.34,10.29 270 top
C11  21.97,29.72 90 bottom
C12  38.48,17.4 90 bottom
C13  49.78,17.4 90 bottom
C14  40.64,17.4 90 bottom
C15  46.1,17.4 90 bottom
C16  48.64,23.88 0 bottom
C17  20.57,10.92 270 top
C18  39.37,7.62 270 bottom
C19  49.02,7.62 270 bottom
C20  10.67,34.16 180 top
C21  10.67,40.13 0 top
C22  37.97,48.13 90 bottom
C23  34.16,48.26 90 bottom
C24  30.23,43.18 0 bottom
C25  29.21,39.5 180 top
C26  24.13,48.26 90 bottom
C27  47.88,48.26 90 bottom
C28  43.94,42.93 0 bottom
C29  42.93,39.5 180 top
C30  75.95,46.86 270 bottom
C31  74.04,43.43 180 top
C32  74.42,41.4 180 top
C33  75.95,36.2 180 top
C34  63.75,45.97 90 top
C35  63.75,43.56 270 bottom
C36  67.18,44.96 0 bottom
C37  63.12,48.9 180 top
C38  99.95,23.62 270 top
C39  99.69,18.92 90 top
C40  82.17,42.93 0 bottom
C41  82.42,34.92 180 top
C42  83.95,40.01 180 top
C43  83.95,46.74 270 bottom
C44  85.09,24.77 180 top
C45  82.42,32.77 0 top
C46  90.17,42.93 180 top
C47  90.17,40.77 0 bottom
C48  91.95,37.47 180 top
C49  91.95,46.86 270 bottom
C50  88.27,32.77 180 top
C51  93.73,30.35 0 bottom
C52  98.3,42.93 0 bottom
C53  98.3,38.35 0 bottom
C54  99.95,40.26 180 top
C55  99.95,46.86 270 bottom
C56  67.06,18.41 90 bottom
C57  83.06,16.51 180 bottom
C58  83.06,10.54 180 bottom
C59  80.9,4.83 0 top
C60  65.66,21.08 180 bottom
C61  65.91,15.37 180 bottom
C62  65.91,9.27 180 bottom
C63  86.87,20.83 0 bottom
C64  86.87,8.64 0 bottom
C65  86.87,14.73 0 bottom
CONN1  102.87,20.07 0 top
D1  17.53,31.62 0 top
D2  76.33,19.94 0 top
D3  76.33,14.86 0 top
D4  76.33,8.89 0 top
FB1  35.69,31.37 180 bottom
FB2  34.92,17.4 90 bottom
FB3  77.72,42.42 270 top
FB4  58.42,47.5 270 top
FB5  85.72,42.93 270 bottom
FB6  93.73,41.91 270 bottom
FB7  101.73,42.93 270 bottom
FB8  66.55,23.62 0 bottom
IC1  54.1,30.48 0 top
IC2  64.26,30.1 90 top
IC3  24,21.59 90 top
IC4  41.66,18.8 180 top
IC5  29.14,49.86 0 top
IC6  16.26,39.88 90 top
IC7  42.92,49.86 0 top
IC8  75.95,47.12 270 top
IC9  66.93,45.97 270 top
IC10  83.95,47.12 270 top
IC11  82.8,28.45 180 top
IC12  91.95,47.12 270 top
IC13  90.93,28.45 90 top
IC14  99.95,47.12 270 top
IC15  67.56,20.07 270 top
IC16  86.61,18.72 270 top
IC17  66.8,14.1 270 top
IC18  86.61,12.83 270 top
IC19  66.8,8 270 top
IC20  86.61,6.73 270 top
ICD  53.34,42.04 0 top
J1  5.87,19.18 270 top
L1  10.54,47.88 0 top
LED1  47.75,29.97 270 top
LED2  47.75,31.88 270 top
LED3  47.75,33.78 270 top
LED4  9.78,8.64 90 top
LED5  9.78,6.1 90 top
Q1  52.07,3.56 180 top
Q2  59.44,11.05 270 top
Q3  54.99,12.45 180 top
Q4  58.29,7.62 270 top
Q5  57.4,4.32 270 top
R1  51.44,27.81 180 top
R2  42.29,28.83 180 top
R3  42.29,30.99 180 top
R4  42.29,33.15 180 top
R5  29.21,19.05 90 bottom
R6  30.35,13.72 0 top
R7  25.4,26.04 180 bottom
R8  25.4,23.5 180 bottom
R9  23.5,12.7 90 top
R10  14.1,11.91 0 bottom
R11  31.37,26.04 270 top
R12  14.35,8.64 0 top
R13  14.35,6.1 0 top
R14  25.91,12.7 90 top
R15  17.94,12.83 90 top
R16  54.61,50.55 180 bottom
R17  71.75,48.13 180 bottom
R18  95.5,17.02 0 top
R19  76.45,26.16 270 top
R20  95.38,23.5 270 top
R21  95.5,19.18 180 top
R22  78.36,26.16 270 top
R23  93.47,23.5 270 top
R24  95.12,46.35 90 bottom
R25  72.82,23.04 135 top
R26  73.53,17.27 90 bottom
R27  73.41,11.18 90 bottom
R28  92.58,8.89 180 top
R29  91.69,11.43 270 top
R30  88.27,18.54 0 bottom
R31  88.27,12.32 0 bottom
R32  87.88,5.59 90 bottom
R33  51.94,17.65 270 top
R34  58.93,26.67 180 bottom
R35  54.1,17.65 270 top
R36  55.88,25.4 270 bottom
R37  53.59,26.8 270 bottom
SUPP  3.56,38.99 90 top
TP1  19.56,47.75 0 top
TP2  16.76,47.75 0 top
U$1  42.93,50.55 0 top
U$2  29.21,50.55 0 top
X1  64.77,40.51 180 top
X2  44.2,8.89 0 top

### Tracks (layer width: path | path; a pad name or v marks a point on that pad's centre or on a via)
3V3REF  (via drill 0.6)  (1 unrouted)
  Top 0.305: IC2.16 68.01,25.72 | IC9.5 IC9.6 v67.18,46.99
  Top 0.406: 68.01,25.72 v68.07,25.78 | 64.64,48.9 66.17,48.9 67.18,47.88 v67.18,46.99
  Bottom 0.406: v67.18,46.99 68.13,46.04 C36.1 68.36,44.73 70.36,44.73 71.12,43.97 71.12,36.45 69.47,34.8 69.47,27.18 v68.07,25.78
!MCLR  (via drill 0.6)
  Top 0.203: IC2.7 63.5,24.04
  Top 0.305: IC2.7 63.51,25.39 63.12,25.78 51.82,25.78 50.42,27.18 | IC4.10 38.48,25.78 39.88,27.18 47.88,27.18 | 47.88,27.18 v47.88,36.45 | 47.88,27.18 50.42,27.18 | 50.42,27.18 50.42,27.81 R1.2
  Bottom 0.229: 51.44,40.01 51.44,40.94 ICD.1
  Bottom 0.305: v47.88,36.45 51.44,40.01
+3V3  (via drill 0.6, 0.6 pad 0.25, 1)  (12 unrouted)
  Top 0.229: R3.2 R2.2 | R3.2 R4.2 | v34.8,31.37 40.96,31.37 R3.2 | ICD.2 49.67,43.04 49.66,43.05
  Top 0.254: IC2.10 65.01,26.87 C3.1
  Top 0.279: IC2.26 68.59,30.85 68.07,31.37 | 65.89,27.35 IC2.19
  Top 0.295: 55.52,29.85 IC2.57
  Top 0.305: 68.07,31.37 v68.07,31.62 C2.1 | IC2.38 65.51,33.61 C5.1 65.91,33.21 | 65.91,31.24 65.91,31.37 | IC2.57 60.14,29.85 60.71,30.41 | IC1.2 55.52,29.85
  Top 0.406: v73.41,25.65 69.47,25.65 69.22,25.91 69.22,26.16 68.33,27.05 67.69,27.05 67.39,27.35
  Top 0.61: 65.59,30.41 65.85,30.67 | 65.89,27.35 67.39,27.35
  Top 0.8: 54.25,36.04 52.58,37.72 49.66,37.72
  Top 0.813: 54.25,36.04 55.37,34.92 59.05,34.92 60.45,33.53 v60.45,30.35 | 65.59,30.41 60.71,30.41 C4.1 | 65.91,31.24 65.85,30.67 65.89,29.74 65.89,27.35 65.38,27.35 C3.1 | 65.91,33.21 65.91,31.37 68.07,31.37 | 54.98,46.79 C1.1 55.05,45.67 54.85,45.47 51.18,45.47 49.66,43.94 49.66,43.05 49.66,37.72 34.8,37.72 | v34.8,31.37 34.8,37.72 | C25.+ 33.53,37.72 34.8,37.72
  Bottom 0.305: 77.34,7.79 D4.2
  Bottom 0.406: v73.41,25.65 73.41,24.13 77.34,20.19 v77.34,18.8 v77.34,13.72 77.34,7.79
  Bottom 0.813: C23.1 IC5.OUT 31.68,43.23 C24.1 31.73,39.39 C25.+
  other vias: 65.02,26.92 65.91,33.27 77.34,7.87
+3V3_ENC  (via drill 0.6)  (7 unrouted)
  Top 0.61: v46.1,16.38 C15.1 | 46.1,16.13 v46.1,16.38 | 46.1,16.13 IC4.25 | IC4.28 49.91,16.32 C13.1 | IC4.19 C12.1 38.55,16.38 39.75,16.38 | IC4.20 39.75,16.38 | 39.75,16.38 40.57,16.38 C14.1 40.96,16.13 46.1,16.13 | IC4.15 33.4,16.26 v33.15,16.51 | v38.1,20.83 38.1,17.14 v38.48,16.51 | v46.1,16.38 v49.78,16.38
  Bottom 0.61: 34.86,16.51 v38.48,16.51 | 34.86,16.51 FB2.1 | v33.15,16.51 34.86,16.51 | 38.48,28.51 C9.1 | 38.48,28.51 38.48,21.46 v38.1,20.83 | 38.48,28.51 38.48,30.61 37.72,31.37 FB1.2
  other vias: 40.64,16.38
+5V  (via drill 0.6)  (1 unrouted)
  Top 0.61: IC7.OUT 46.15,48.01 51.44,48.01 52.2,48.77 58.1,48.77 FB4.1
  Bottom 0.6: v58.42,48.39 58.42,50.55 59.05,51.18 94.23,51.18 95.12,50.29 R24.2
  Bottom 0.813: C27.1 IC7.OUT 45.46,42.94 C28.1 45.44,39.52 C29.+
ACC_X  (via drill 0.6)
  Top 0.4: v82.55,23.37 82.62,23.31
  Top 0.6: R20.2 R23.2 92.52,22.42 91.63,23.31 82.62,23.31 | IC18.2 81.66,13.46 v81.41,13.72
  Bottom 0.6: v81.41,13.72 80.77,14.35 80.77,21.59 v82.55,23.37
ACC_Y  (via drill 0.6)
  Top 0.6: R19.2 R22.2 79.82,23.62 v79.88,23.37 | v82.04,7.37 IC20.2
  Bottom 0.6: v82.04,7.37 80.39,7.37 79.88,7.87 v79.88,23.37
ACC_Z
  Top 0.6: R18.1 94.61,19.3 94.61,19.18 R21.2 93.4,19.18 90.83,21.74 86.23,21.74 85.98,21.49 85.98,19.74 85.6,19.36 IC16.2
AGND  (via drill 0.6)  (16 unrouted)
  Top 0.305: C59.2 v81.92,4.83 IC20.4
  Top 0.406: v69.72,16 69.72,16.89 IC15.5
  Top 0.6: IC11.3 84.92,31.21 C45.2 | IC15.7 v68.83,19.43 | IC13.3 92.2,25.08 R23.1
  Top 0.61: IC16.4 v85.7,16.82 | IC18.4 v84.07,10.54 | IC19.7 v70.99,7.37 | IC19.5 v70.99,4.83 | IC17.7 v70.99,13.46 | IC17.5 v70.99,10.92 | IC10.4 81.35,43.05 C40.2 | IC12.4 89.35,43.05 C46.2 | IC14.4 C52.2 | IC8.4 73.22,45.21 73.22,43.56 C31.2 | C32.2 73.47,42.23 73.03,42.67 v73.03,43.43
  other vias: 81.15,42.93 89.28,42.93 97.41,42.93 83.44,32.77 78.36,27.05 93.47,24.51 75.44,7.75 75.44,13.72 75.44,18.8 102.87,16.26 87.38,32.77 81.41,34.92 84.2,24.77 96.39,19.18 99.57,19.94 99.95,22.61
  pour Bottom (isolate 0.406, no thermals): 64.64,0.25 105.41,-0.13 107.19,52.45 72.52,52.45 72.52,33.91 71.75,33.15 71.75,30.35 68.71,27.3 68.07,27.3 64.64,23.88
AN+5V  (via drill 0.6)  (9 unrouted)
  Top 0.305: C64.1 IC20.8 | 64.9,20.7 IC15.1 | IC17.1 64.26,14.73 | 91.38,8.64 R28.2 91.63,10.42 R29.2
  Top 0.6: 87.82,20.63 IC16.8 | C65.1 IC18.8 | v64.9,20.95 64.9,20.7 | 64.26,14.73 v64.9,15.37 | IC19.1 65.02,8.64 v65.02,9.27 | v95.45,42.8 95.45,31.55 96.34,30.66
  Top 0.61: v97.92,22.73 97.92,25.78 96.34,27.36 96.34,30.66 | IC20.8 91.57,8.64 91.63,8.7 R28.2
  Bottom 0.305: 87.82,14.67 v87.76,14.73 | 87.76,18.54 R30.2 | 87.82,6.6 R32.2 87.82,6.48 | R31.2 87.82,12.82
  Bottom 0.6: v87.76,14.73 87.76,18.54 87.76,20.77 | 87.82,12.82 87.82,14.67 | 87.82,6.48 86.61,6.48 86.23,6.1 86.23,3.43 85.72,2.92 65.41,2.92 65.02,3.3 v65.02,9.27 65.02,15.37 C61.1 | C60.1 v64.9,20.95 v64.9,15.37 | R24.1 95.45,44.57 v95.45,42.8
  Bottom 0.61: v97.92,22.73 96.01,20.83 C63.1 | 87.82,6.6 87.76,6.67 v87.76,8.64 87.76,10.16 87.31,10.6 R31.2
  other vias: 87.76,20.53
AN+9V  (via drill 0.6)  (7 unrouted)
  Top 0.61: IC8.2 75.89,47.75 C30.1 | IC10.2 83.88,47.75 C43.1 v83.95,47.75 | IC12.2 91.89,47.75 C49.1 91.95,50.42 | IC14.2 99.89,47.75 C55.1 v99.95,47.88 99.95,50.42 91.95,50.42 | C30.1 v75.95,47.88 | 83.95,50.42 v83.95,47.75 | v83.95,47.75 83.95,49.91 | 83.95,50.42 91.95,50.42 | 75.95,50.42 56.14,50.42 R16.2 | 75.95,50.42 C30.1 | 75.95,50.42 83.95,50.42
  other vias: 91.95,47.75 56.01,50.55
CS_ETH
  Top 0.29: 52.83,19.68 54.61,19.68 55.37,20.45 62.48,20.45 64.01,21.97 IC2.8
  Top 0.305: IC4.9 39.75,20.7 40.01,20.45 52.07,20.45 52.83,19.68 | IC2.8
CS_PGA1  (via drill 0.6)
  Top 0.29: v56.64,27.81 57.11,27.35 IC2.62
  Bottom 0.29: v56.64,27.81 57.91,27.81 R34.1
CS_PGA1_5V  (via drill 0.6)
  Top 0.29: 85.72,3.56 61.72,3.56 60.58,4.7 60.58,11.05
  Top 0.305: 85.72,3.56 85.98,3.81 85.98,15.42 87.38,16.82 IC16.5 v89.66,16.38 | 60.58,11.05 Q2.3
  Bottom 0.305: R30.1 IC16.5 v89.66,16.38
CS_PGA2  (via drill 0.6)
  Top 0.29: IC2.63 55.7,26.85 55.37,27.18
  Top 0.305: v55.37,27.56 55.37,27.18
  Bottom 0.305: R36.1 55.37,26.35 v55.37,27.56
CS_PGA2_5V  (via drill 0.6)
  Top 0.29: 86.23,2.92 60.71,2.92 59.82,3.81 59.82,7.11 59.31,7.62
  Top 0.305: 86.23,2.92 86.61,3.3 86.61,10.67 86.87,10.92 IC18.5 89.21,10.35 v89.53,10.03 | 59.31,7.62 Q4.3
  Bottom 0.305: R31.1 89.22,10.35 v89.53,10.03
CS_PGA3  (via drill 0.6)
  Top 0.29: 54.3,26.35 IC2.64
  Top 0.305: 54.3,26.35 53.98,26.67 v53.98,27.69
  Bottom 0.305: v53.98,27.69 53.91,27.75 R37.1
CS_PGA3_5V  (via drill 0.6)
  Top 0.29: 86.74,2.29 59.56,2.29 58.55,3.3 58.55,4.28
  Top 0.3: 58.55,4.28 Q5.3
  Top 0.305: 86.74,2.29 87.25,2.79 87.25,4.45 87.63,4.83 IC20.5 89.41,4.63 v89.41,3.05
  Bottom 0.305: R32.1 87.88,3.56 88.39,3.05 v89.41,3.05
CS_REF1  (via drill 0.6)
  Top 0.29: IC2.3 61.51,22.65 v61.47,22.61 | v61.47,19.43 IC15.2
  Bottom 0.29: v61.47,19.43 v61.47,22.61
CS_REF2  (via drill 0.6)
  Top 0.29: IC2.2 61.01,23.42 60.33,22.73 v60.2,22.73 | IC17.2 59.82,13.46 59.69,13.59 v59.69,18.54
  Bottom 0.29: v60.2,22.73 60.2,20.07 59.69,19.56 v59.69,18.54
CS_REF3  (via drill 0.6)
  Top 0.29: IC2.1 60.12,24.05 58.93,22.86 v58.93,22.73 | v58.67,17.27 58.67,13.21 58.93,12.95 61.34,12.95 61.59,12.7 61.59,7.62 61.85,7.37 IC19.2
  Bottom 0.29: v58.93,22.73 58.93,21.21 58.67,20.95 v58.67,17.27
GND  (via drill 0.6, 0.6 pad 0.25, 1, 3 pad 5.5)  (15 unrouted)
  Top 0.254: IC2.9 64.51,25.47 C3.2
  Top 0.279: IC2.20 68.29,27.85 68.07,28.19 | C2.2 68.64,30.35 IC2.25
  Top 0.3: v58.17,10.16 58.27,10.16 Q2.2 | v56.9,6.73 56.83,6.67 Q4.2 | v56.01,3.43 56.07,3.37 Q5.2 | v52.96,13.59 53.02,13.53 Q3.2
  Top 0.305: IC9.2 IC9.1 C34.2 | C5.2 64.01,33.34 IC2.41 | IC4.11 37.21,27.94 36.7,28.45 C9.2 | R11.1 v31.37,27.69 31.37,27.56 31.24,27.56 31.24,27.84 31.37,27.84 R11.1 | R11.1 31.37,27.43 31.62,27.43 31.62,27.56 30.99,27.56 30.99,27.46 R11.1
  Top 0.406: C34.2 62.04,46.92 61.59,47.37 61.59,48.87 C37.2
  Top 0.61: IC1.3 53.98,31.5 | IC4.2 v48.64,25.65 | IC4.18 37.21,11.94 37.72,11.43 v40.39,11.43 41.02,12.06 IC4.21 IC4.22 | 20.57,8.51 v20.57,8.76 C17.2
  Top 0.813: 68.07,28.19 C2.2
  Bottom 0.61: 47.75,26.04 47.75,26.29 v48.64,25.65 | v36.7,28.57 36.58,28.7 | 29.34,7.24 v29.34,9.27
  Bottom 0.711: 31.37,27.84 31.37,34.67 | C11.2 arc90 22.1,30.8 22.1,33.53
  Bottom 0.813: 20.57,7.49 v20.57,8.76
  other vias: 63.75,46.86 53.09,47.12 63.88,33.27 68.07,29.84 63.12,26.92 54.1,31.5 51.05,4.7 20.07,31.62 9.02,40.13 3.68,46.74 12.45,34.16 3.68,31.37 8,6.1 8,8.64 3.68,3.43
  pour Bottom (isolate 0.406, rank 2, no thermals): -1.91,51.44 -1.91,-1.65 106.81,-1.91 108.71,53.72
ICDC
  Top 0.22: IC2.48 56.43,36.15 55.37,37.21 55.37,41.01 ICD.5
ICDD
  Top 0.22: IC2.47 61.01,36.91 60.96,36.96 56.77,36.96 56.64,37.08 56.64,43.94 56.39,44.2 53.85,44.2 53.34,43.69 ICD.4
INT0  (via drill 0.6)
  Top 0.254: IC4.4 46.1,25.4 v45.85,25.65 | IC2.35 67.01,37.51 v66.93,37.59
  Bottom 0.254: v66.93,37.59 53.34,37.59 45.85,30.1 v45.85,25.65
LED0
  Top 0.229: IC2.50 51.38,33.35 49.91,31.88 LED2.C
LED1
  Top 0.229: IC2.49 49.57,33.85 arc90 LED3.C
LED2
  Top 0.229: IC2.51 52.66,32.85 49.78,29.97 LED1.C
N$1  (via drill 0.6)  (2 unrouted)
  Top 0.305: 82.04,18.09 IC16.3 | 82.04,18.09 82.04,16.58 C57.1 | IC15.8 71.63,20.7 72.01,20.32 72.01,17.91 72.26,17.65 79.25,17.65 79.68,18.09 82.04,18.09
  other vias: 82.04,16.51
N$2  (via drill 0.6)  (2 unrouted)
  Top 0.305: IC18.3 82.04,12.19 82.04,12.06 | 82.04,12.06 82.04,10.61 C58.1 | IC17.8 71.75,14.73 72.01,14.48 72.01,12.45 72.26,12.19 81.92,12.19 82.04,12.06
  other vias: 82.04,10.54
N$3  (via drill 0.6)  (2 unrouted)
  Top 0.61: IC12.6 92.58,46.48 91.95,45.85 91.95,42.93 | C46.1 91.95,42.93 | 91.95,42.93 93.66,42.93 FB6.1
  other vias: 93.73,42.8
N$4  (via drill 0.6)  (3 unrouted)
  Top 0.61: IC14.6 100.58,46.48 99.95,45.85 99.95,43.88 | C52.1 v99.31,42.93 99.95,42.93 99.95,43.88 | 99.95,43.88 FB7.1
  other vias: 101.73,43.81
N$5
  Top 0.61: IC3.15 21.97,18.41 23.5,16.89 R9.2
N$6  (via drill 0.6)  (2 unrouted)
  Top 0.61: v30.86,18.41 IC3.2 | R6.1 29.4,11.3 C10.1
  Bottom 0.61: FB2.2 34.99,18.41 v30.86,18.41 29.52,18.41 R5.1 29.21,13.91 R6.1
  other vias: 29.34,13.72
N$7
  Top 0.61: IC3.10 21.46,24.77 21.84,24.38 21.84,20.32 22.35,19.81 25.4,19.81 25.91,19.3 R14.2
N$8
  Bottom 0.6: C11.1 23.18,28.77 24.38,27.56 24.38,26.1 R7.1
  Bottom 0.686: R8.1 R7.1
N$9  (via drill 0.6)  (2 unrouted)
  Top 0.61: R14.1 R9.1 20.58,11.75 | 20.58,11.75 C17.1 | 20.58,11.75 18.07,11.75 R15.1
  Bottom 0.61: R10.1 17.91,11.91 R15.1
  other vias: 17.91,11.81
N$10  (via drill 0.6)
  Top 0.3: Q2.1 58.1,12
  Top 0.305: v58.93,24.13 58.67,24.13 57.4,22.86 56.64,22.86 v56.64,22.61 | 58.1,12 v58.17,11.94
  Bottom 0.29: 56.64,12.83 v56.64,22.61
  Bottom 0.3: 56.64,12.83 57.53,11.94 v58.17,11.94
  Bottom 0.305: R34.2 59.88,25.08 v58.93,24.13
N$11  (via drill 0.6)  (2 unrouted)
  Top 0.305: 67.82,12.19 IC17.6
  Top 0.4: IC19.6 68.07,6.1 67.82,6.35 67.82,12.19 67.82,17.46 | 67.82,18.29 IC15.6 | 67.82,17.46 67.82,18.29 | 67.82,17.46 C56.1 | 67.82,18.29 67.82,20.32 67.06,21.08 66.67,21.08 65.91,21.84 65.66,21.84 v64.9,22.61
  Bottom 0.4: FB8.2 65.6,23.18 v64.9,22.61
  other vias: 67.06,17.53
N$12  (via drill 0.6)  (3 unrouted)
  Top 0.61: C34.1 IC9.3 IC9.4 | FB4.2 60.01,44.96 C35.1
  other vias: 63.75,44.96
N$13  (1 unrouted)
  Top 0.61: IC8.6 76.58,46.48 75.95,45.85 75.95,43.43 | C31.1 75.95,43.43 | 75.95,43.43 77.66,43.43
N$14
  Bottom 0.61: J1.4 J1.5 10.7,17.02 10.7,13.34 12.1,11.94 12.19,11.91 R10.2
N$15
  Top 0.61: J1.8 16.98,14.73 R15.2
  Bottom 0.61: J1.8 J1.7
N$16  (via drill 0.6)  (2 unrouted)
  Top 0.305: v49.02,8.64 C19.1
  Top 0.686: IC4.24 44.83,10.03 45.97,8.89 X2.2 48.13,8.89 48.01,8.76
N$17  (via drill 0.6)  (2 unrouted)
  Top 0.305: X2.1 C18.1
  Top 0.686: IC4.23 43.56,9.91 42.55,8.89 X2.1
  other vias: 39.37,8.64
N$18
  Top 0.686: R11.2 IC4.14
N$19  (via drill 0.6)  (2 unrouted)
  other vias: 50.04,23.88
N$20
  Top 0.305: IC19.8 71.63,8.64 72.01,8.26 72.01,6.48 72.39,6.1 79.88,6.1 | 79.88,6.1 IC20.3 | 79.88,6.1 79.88,4.89 C59.1
N$21  (via drill 0.6)
  Top 0.305: v56.01,9.78 56.01,5.33 56.24,5.33 Q5.1
  Bottom 0.29: R37.2 53.59,23.88 54.74,22.73 54.74,11.94
  Bottom 0.305: 54.74,11.94 56.01,10.67 v56.01,9.78
N$22
  Top 0.254: LED4.A R12.1
N$23
  Top 0.254: LED5.A R13.1
N$24
  Top 0.254: R12.2 18.8,8.64 20.7,6.73 52.07,6.73 52.58,7.24 52.58,10.67 52.32,10.92 47.75,10.92 47.5,11.18 47.5,13.64 IC4.26
N$25  (1 unrouted)
  Top 0.254: 15.24,6.1 52.7,6.1 53.09,6.48 53.09,11.18 52.58,11.68 48.77,11.68 48.64,11.81 IC4.27
N$26
  Top 0.29: 78.23,28.57 78.23,28.45
  Top 0.6: 78.23,28.45 IC11.6 | C45.1 78.61,32.77 78.23,32.38 78.23,28.57 76.71,28.57 76.45,28.32 R19.1
N$27  (via drill 0.6)  (1 unrouted)
  Top 0.6: IC13.6 90.93,31.75 91.31,32.13 93.22,32.13 93.47,31.88 93.47,30.35 v94.74,30.35 94.74,29.46 95.38,28.83 R20.1
N$28  (via drill 3 pad 5.5)
  other vias: 100.71,31.37
N$29  (via drill 0.6)
  Top 0.29: 99.5,18.03 C39.1 | 102.8,18.73 CONN1.T3
  Top 0.6: R18.2 97.66,17.02 98.68,18.03 99.5,18.03 | C39.1 101.92,17.97 102.36,18.67 102.8,18.73
  other vias: 102.87,18.8
N$30  (via drill 0.6)
  Top 0.813: 20.7,47.62 20.57,47.75 | 40.3,47.24 IC7.IN 40.38,45.6 41.02,44.96 48.39,44.96 v50.04,46.61
  Top 1.016: IC6.3 20.7,37.34 20.7,47.62 | 20.57,47.75 TP1.TP | IC5.IN 26.6,45.79 27.43,44.96 34.8,44.96 35.43,45.59 35.43,46.74 35.94,47.24 40.3,47.24
  Bottom 0.813: C26.1 | IC7.IN 38.11,47.32 C22.1 | IC5.IN | v50.04,46.61 50.04,49.66 50.93,50.55 R16.1
  Bottom 1.016: TP1.TP 20,47.31 C26.1 IC5.IN
N$34  (via drill 0.6)  (3 unrouted)
  Top 0.61: IC10.6 84.58,46.48 83.95,45.85 83.95,43.94 | C40.1 v83.19,42.93 83.95,42.93 83.95,43.94 | 83.95,43.94 85.66,43.94 FB5.1
  other vias: 85.72,43.81
N$35
  Top 0.813: C21.+ 13.84,41.58 13.84,42.42 | 13.84,42.42 13.84,47.75 | 13.84,47.75 13.72,47.88 L1.2 | 13.84,42.42 IC6.1 | 13.84,47.75 TP2.TP
N$36
  Top 0.305: R33.2 51.94,12.95 52.32,12.57 52.96,12.57 53.85,11.68 53.85,5.48 Q1.1 | Q1.1 52.96,4.72 | Q1.1 53.06,4.7
N$41
  Top 0.61: 8.89,34.11 C20.+
  Top 0.813: L1.1 7.62,43.81 6.6,42.77 6.6,40.64 | 6.6,40.64 6.6,35.31 7.75,34.16 C20.+ | D1.C 10.03,31.62 8.89,32.77 8.89,34.11 | SUPP.2 6.5,40.74 6.6,40.64
N$46  (via drill 0.6)
  Top 0.295: IC2.56 56.9,30.35 56.64,30.61
  Top 0.305: 56.64,30.61 v56.64,31.37
  Bottom 0.305: v56.64,31.37 C6.2
N$47
  Top 0.305: R1.1 53.15,28.58 IC1.1
N$48  (via drill 0.6)  (1 unrouted)
  Top 0.279: X1.2 60.2,40.77 C8.1 v60.2,40.89
  Top 0.29: IC2.40 64.51,38.99 62.99,40.51
  Top 0.305: X1.2 62.99,40.51
N$49  (via drill 0.6)  (1 unrouted)
  Top 0.279: v69.47,40.77 69.6,40.64 X1.1
  Top 0.29: IC2.39 65.01,38.98 66.55,40.51
  Top 0.305: 66.55,40.51 X1.1 70.29,41.08
N$51
  Top 0.305: R35.2 54.1,16.64 56.01,14.73 56.01,13.61 Q3.1
N$53  (via drill 0.6)
  Top 0.305: v57.15,8.51 57.15,8.57 Q4.1
  Bottom 0.29: 55.63,12.45 55.63,23.11
  Bottom 0.305: v57.15,8.51 57.15,10.92 55.63,12.45 | 55.63,23.11 55.88,23.37 R36.2
N$60
  Top 0.229: LED3.A 43.88,33.78 R4.1
N$61
  Top 0.229: LED2.A 44.58,31.88 43.69,30.99 R3.1
N$62
  Top 0.229: LED1.A 45.09,29.97 43.94,28.83 R2.1
S$3  (via drill 3 pad 5.5)
  other vias: 100.71,3.43
SCK  (via drill 0.6)  (2 unrouted)
  Top 0.305: IC4.8 41.02,24.89 42.67,26.54 50.04,26.54 51.44,25.15 51.94,25.15 | IC2.4 62.01,24.86 61.72,25.15 57.66,25.15 | 51.94,25.15 57.66,25.15 | 51.94,25.15 v51.94,22.86 | IC19.3 62.61,6.1 v62.48,6.22 | IC17.3 64.14,12.19 | IC17.3 64.26,12.19 | v62.48,12.19 IC17.3 | v62.48,18.16 IC15.3 | 57.66,25.15 v57.66,24.64
  Bottom 0.29: v57.66,24.64 57.66,16.64 | 58.04,16.26 62.48,16.26
  Bottom 0.3: 57.66,16.64 58.04,16.26
  Bottom 0.305: v51.94,22.86 R33.1 | v62.48,6.22 v62.48,12.19 62.48,16.26 v62.48,18.16
  other vias: 51.94,18.54
SCK_5V
  Top 0.305: IC16.7 91.44,19.36 92.58,18.21 92.58,13.46 | 92.58,13.46 IC18.7 | 92.58,7.49 92.46,7.37 IC20.7 | 92.58,7.49 92.58,1.27 92.33,1.02 53.51,1.02 Q1.3 | 92.58,7.49 93.6,8.51 | 93.6,8.51 94.36,8.51 94.74,8.89 94.74,13.08 94.36,13.46 92.58,13.46 | 93.6,8.51 93.6,8.89 R28.1
SDI
  Top 0.203: IC2.5 62.48,24.02
  Top 0.29: 44.32,21.72 61.98,21.72 62.51,22.25 IC2.5
  Top 0.305: IC4.6 43.56,22.48 44.32,21.72
SDO  (via drill 0.6)  (1 unrouted)
  Top 0.203: IC2.6 62.99,24.03
  Top 0.29: 53.34,21.08 62.23,21.08 62.99,21.84 63.01,21.84 IC2.6 | 54.61,18.67 55.75,19.81 60.07,19.81 60.58,19.3 60.58,17.14 60.83,16.89 IC15.4
  Top 0.3: 54.61,18.67 54.17,18.67 R35.1
  Top 0.305: IC4.7 42.29,21.84 43.05,21.08 53.34,21.08 v53.34,20.57 | IC19.4 66.04,4.83 66.29,5.08 66.29,10.92 | 66.29,10.92 IC17.4 | 66.29,10.92 66.29,16.76 66.04,17.02 IC15.4 | v53.72,18.67 53.84,18.67 53.93,18.76 53.95,18.76 R35.1
  Bottom 0.3: v53.34,20.57 53.34,19.3 R35.1
  Bottom 0.305: R35.1 53.72,18.98
SDO_5V  (via drill 0.6)  (1 unrouted)
  Top 0.305: IC20.6 v90.93,6.1 90.93,1.91 90.68,1.65 55.37,1.65 54.99,2.03 Q3.3 | v91.44,12.19 IC18.6 | v90.93,18.09 IC16.6
  Bottom 0.305: 90.93,12.19 v90.93,18.09 | 90.93,12.19 v91.44,12.19 | v90.93,6.1 90.93,12.19
  Bottom 0.406: v91.44,12.19 91.19,12.32
STX  (via drill 0.6)
  Top 0.279: IC2.22 71.86,28.85 72.14,28.57 v74.68,28.57 | v91.06,28.57 92.93,28.57 IC13.4
  Bottom 0.279: v74.68,28.57 v91.06,28.57
STY  (via drill 0.6)
  Top 0.279: 73.53,31.11 v76.71,31.11 | v79.63,31.11 82.26,31.11 IC11.4
  Top 0.3: IC2.23 71.77,29.35 73.53,31.11
  Bottom 0.279: v76.71,31.11 v79.63,31.11
STZ  (via drill 0.6)
  Top 0.279: IC2.21 71.47,28.35 73.15,26.67 74.17,26.67 75.06,25.78 75.06,24.38 77.09,22.35 85.72,22.35 85.91,22.51 91.29,22.51 92.46,21.34 CONN1.T2
  other vias: 102.87,21.34
TPIN+1  (via drill 0.6)  (2 unrouted)
  Top 0.61: IC4.13 34.67,22.48 33.91,21.72 31.24,21.72 29.46,23.5 IC3.6 R8.2
  other vias: 26.29,23.5
TPIN+2
  Top 0.508: J1.3 12.22,21.72 14.13,23.62 17.78,23.62 17.91,23.5 IC3.11
TPIN-1  (via drill 0.6)  (2 unrouted)
  Top 0.61: IC4.12 35.94,25.15 35.05,26.04 IC3.8 R7.2
  other vias: 26.29,26.04
TPIN-2
  Top 0.508: IC3.9 10.57,26.04 10.06,25.53 10.06,17.91 10.7,17.27 J1.6
TPOUT+1
  Top 0.61: 31.62,13.72 31.62,12.06 32.26,11.43 35.43,11.43 35.94,11.94 IC4.17 | 31.62,13.72 31.62,16.64 31.11,17.14 IC3.1 | 31.62,13.72 R6.2
TPOUT+2
  Top 0.508: IC3.16 16.54,17.14 16.29,17.4 16.29,18.29 16.03,18.54 14,18.54 12.99,19.81 11.46,19.81 10.95,20.32 10.95,23.24 11.34,23.62 J1.1
TPOUT-1  (via drill 0.6)
  Top 0.61: IC3.3 v32.77,19.68 34.67,17.78 IC4.16
  Bottom 0.61: R5.2 32.45,20 v32.77,19.68
TPOUT-2
  Top 0.508: IC3.14 16.8,19.68 16.54,19.94 16.54,22.1 16.29,22.35 J1.2
VREF+5V  (via drill 0.6)
  Top 0.6: FB3.2 C33.+ 77.72,34.67 77.34,34.29 v72.52,34.29
  Top 0.61: C32.1 77.66,41.4 FB3.2
  Bottom 0.4: FB8.1 68.83,24.89 71.75,27.81 71.75,33.53 v72.52,34.29
X  (via drill 0.6)
  Top 0.25: 67.18,22.61 67.01,22.78 IC2.14
  Top 0.4: v73.53,19.56 73.53,20.45 70.74,23.24 69.85,23.24 69.22,22.61 67.18,22.61
  Bottom 0.6: v73.53,19.56 R26.2
X_VCC_5V
  Top 0.29: 89.57,32.53 89.6,32.51 | 88.81,30.53 88.77,30.57
  Top 0.305: 89.66,32.64 89.57,32.55 89.57,32.53 89.45,32.53 C50.1
  Top 0.6: 88.77,30.57 IC13.7 89.66,32.64 89.66,32.77 90.04,33.15 93.34,33.15 93.73,33.53 C48.+ | IC13.8 88.81,30.53
  Bottom 0.61: C47.1 93.53,40.77 FB6.2 C48.+
XAMP  (via drill 0.6)  (2 unrouted)
  Top 0.279: R26.1 73.59,16.38
  Top 0.6: IC18.1 78.63,14.73 77.4,15.96 D3.3 73.9,15.96 R26.1
  other vias: 73.53,16.26
Y  (via drill 0.6)
  Top 0.25: 66.51,22.13 IC2.13
  Top 0.4: v70.48,22.1 70.23,22.35 70.36,22.35 69.98,21.97 66.67,21.97 66.51,22.13
  Bottom 0.6: R27.2 73.41,14.22 73.03,14.61 71.63,14.61 71.37,14.86 71.37,21.21 v70.48,22.1
Y_VCC_5V
  Top 0.279: IC11.8 82.8,26.04
  Top 0.6: IC11.7 81.95,27.18 IC11.8 | C42.+ 85.72,34.92 85.72,31.75 86.87,30.61 86.87,26.54 86.36,26.04 86.23,26.04 82.8,26.04
  Top 0.61: 85.72,34.92 C41.1 | C44.1 86.04,25.84 86.23,26.04
  Bottom 0.61: C42.+ FB5.2
YAMP  (via drill 0.6)  (2 unrouted)
  Top 0.279: R27.1 73.47,10.29
  Top 0.6: IC20.1 78.76,8.64 77.4,9.99 D4.3 76.09,10.23 R27.1
  other vias: 73.41,10.16
Z  (1 unrouted)
  Top 0.25: 69.22,23.88 68.58,23.24 67.69,23.24 67.51,23.42 IC2.15
  Top 0.279: 72.15,23.86 72.14,23.88 | 72.11,23.88 R25.2
  Top 0.4: 69.22,23.88 72.11,23.88
Z_VCC_5V  (via drill 0.6)
  Top 0.305: 100.46,24.51 100.46,24.57 C38.1
  Top 0.6: C54.+ 101.73,37.08 101.09,36.45 99.95,36.45 99.69,36.2 97.54,36.2 96.39,35.05 96.39,32.13 97.28,31.24 97.28,27.69 99.69,25.27
  Top 0.61: 99.69,25.27 100.46,24.51 CONN1.B1
  Bottom 0.61: C53.1 101.09,38.35 101.73,38.99 C54.+ FB7.2
  other vias: 102.87,24.51
ZAMP
  Top 0.279: R25.1 73.52,22.37
  Top 0.6: IC16.1 78.2,20.63 77.78,21.04 D2.3 arc90 76.28,21.59 74.3,21.59 73.52,22.37

### Text on the board
tNames: TJ/2011